# Altium project LGA Package.PrjPcb
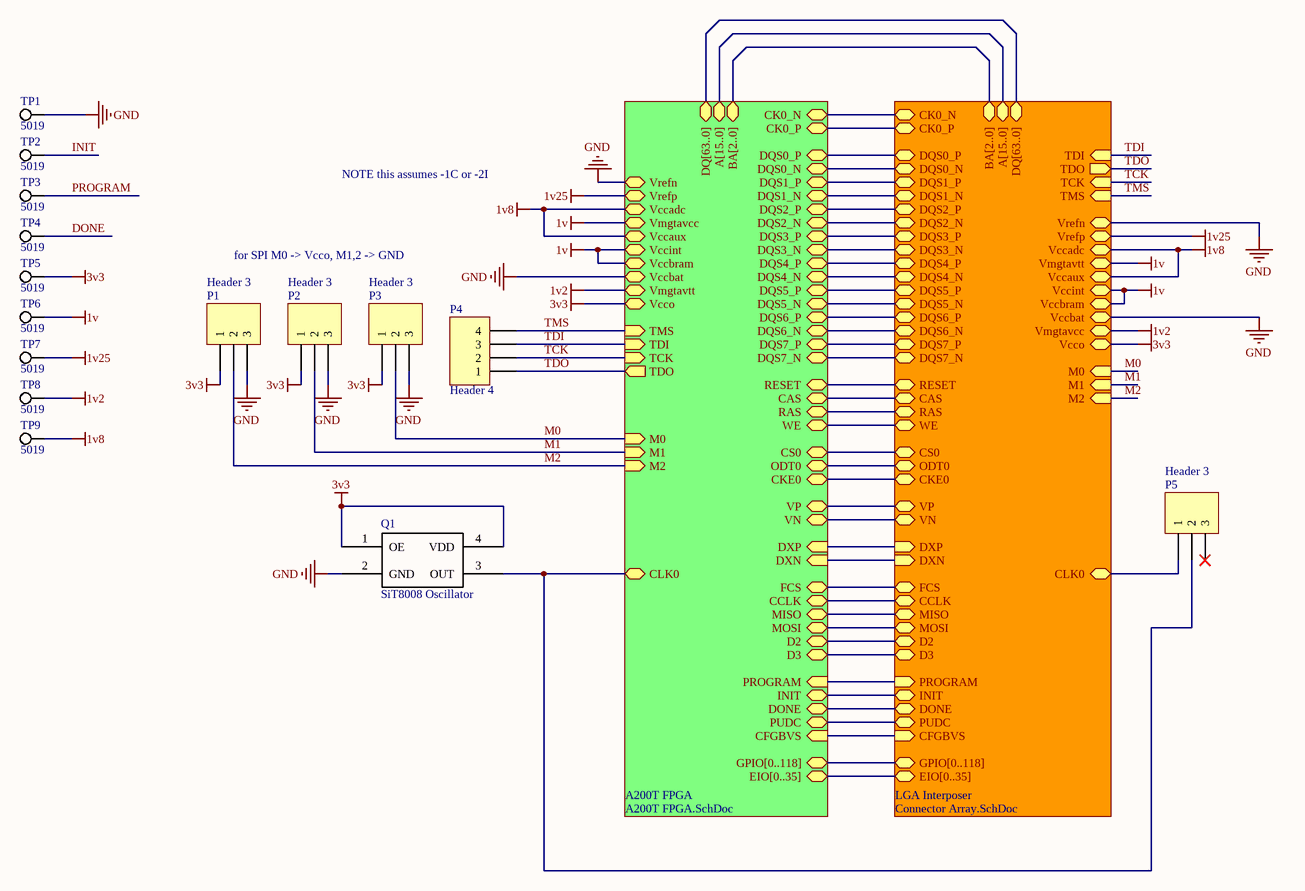
[diagram p0: Top.SchDoc]
3 sheets, 51 parts. Net scope: hierarchical (ports join the sheet entries above them; power ports are global).
Board file: LGA Interposer.PcbDoc
Sheets:
  Top.SchDoc
    A200T FPGA = A200T FPGA.SchDoc
    LGA Interposer = Connector Array.SchDoc

## Sheet Top.SchDoc
size A2; SheetNumber: 1; SheetTotal: 3

### Parts
P1  Header 3  [HDR1X3]
P2  Header 3  [HDR1X3]
P3  Header 3  [HDR1X3]
P4  Header 4  [HDR1X4]
P5  Header 3  [HDR1X3]
Q1  SiT8008 Oscillator  [SiT8008 2.5x2]
TP1  5019  [KSTN-5019_V]
TP2  5019  [KSTN-5019_V]
TP3  5019  [KSTN-5019_V]
TP4  5019  [KSTN-5019_V]
TP5  5019  [KSTN-5019_V]
TP6  5019  [KSTN-5019_V]
TP7  5019  [KSTN-5019_V]
TP8  5019  [KSTN-5019_V]
TP9  5019  [KSTN-5019_V]

### Sub-sheets
A200T FPGA = A200T FPGA.SchDoc: BA[2..0] (bidir), A[15..0] (bidir), DQS1_P (bidir), DQS2_N (bidir), DQS7_N (bidir), DQS0_P (bidir), DQS6_N (bidir), DQS6_P (bidir), DQS1_N (bidir), DQS7_P (bidir), DQS4_P (bidir), DQS5_N (bidir), DQS3_P (bidir), DQS0_N (bidir), DQS2_P (bidir), DQS3_N (bidir), DQS4_N (bidir), DQS5_P (bidir), RAS (bidir), RESET (bidir), WE (bidir), CAS (bidir), CK0_P (bidir), CK0_N (bidir), ODT0 (bidir), CS0 (bidir), CKE0 (bidir), Vrefp (bidir), Vccadc (bidir), Vmgtavcc (bidir), Vccaux (bidir), Vccint (bidir), Vccbram (bidir), Vccbat (bidir), Vmgtavtt (bidir), Vcco (bidir), DQ[63..0] (bidir), Vrefn (bidir), PUDC (bidir), FCS (bidir), CCLK (bidir), INIT (bidir), MISO (bidir), DONE (bidir), MOSI (bidir), D2 (bidir), D3 (bidir), CLK0 (bidir), VP (bidir), VN (bidir), EIO[0..35] (bidir), GPIO[0..118] (bidir), TDO (out), CFGBVS (in), TMS (in), TCK (in), PROGRAM (in), TDI (in), DXP (in), M2 (in), M0 (in), DXN (in), M1 (in)
LGA Interposer = Connector Array.SchDoc: DQS0_P (bidir), DQS0_N (bidir), DQS1_P (bidir), DQS1_N (bidir), DQS2_P (bidir), DQS2_N (bidir), DQS3_P (bidir), DQS3_N (bidir), DQS4_P (bidir), DQS4_N (bidir), DQS5_P (bidir), DQS5_N (bidir), DQS6_P (bidir), DQS6_N (bidir), DQS7_P (bidir), DQS7_N (bidir), DQ[63..0] (bidir), A[15..0] (bidir), BA[2..0] (bidir), CK0_N (bidir), CK0_P (bidir), RAS (bidir), CAS (bidir), WE (bidir), RESET (bidir), CKE0 (bidir), ODT0 (bidir), CS0 (bidir), TDI (in), TDO (out), TCK (in), TMS (in), DXP (in), DXN (in), CLK0 (bidir), M0 (in), CCLK (bidir), M1 (in), M2 (in), DONE (bidir), INIT (bidir), PROGRAM (in), CFGBVS (in), MOSI (bidir), MISO (bidir), PUDC (bidir), FCS (bidir), D2 (bidir), D3 (bidir), Vccint (bidir), Vccaux (bidir), Vccbram (bidir), Vcco (bidir), Vccbat (bidir), Vmgtavcc (bidir), Vmgtavtt (bidir), Vccadc (bidir), Vrefp (bidir), Vrefn (bidir), EIO[0..35] (bidir), GPIO[0..118] (bidir), VP (bidir), VN (bidir)

### Nets
1v: TP6.1 ; sheet A200T FPGA/Vmgtavcc, sheet A200T FPGA/Vccint, sheet A200T FPGA/Vccbram, sheet LGA Interposer/Vccint, sheet LGA Interposer/Vccbram, sheet LGA Interposer/Vmgtavtt  [project net Vccbram]
1v2: TP8.1 ; sheet A200T FPGA/Vmgtavtt, sheet LGA Interposer/Vmgtavcc  [project net Vmgtavcc]
1v8: TP9.1 ; sheet A200T FPGA/Vccadc, sheet A200T FPGA/Vccaux, sheet LGA Interposer/Vccaux, sheet LGA Interposer/Vccadc  [project net Vccadc]
1v25: TP7.1 ; sheet A200T FPGA/Vrefp, sheet LGA Interposer/Vrefp  [project net Vrefp]
3v3: P1.1 P2.1 P3.1 Q1.1(OE) Q1.4(VDD) TP5.1 ; sheet A200T FPGA/Vcco, sheet LGA Interposer/Vcco  [project net Vcco]
GND: P1.3 P2.3 P3.3 Q1.2(GND) TP1.1 ; sheet A200T FPGA/Vccbat, sheet A200T FPGA/Vrefn, sheet LGA Interposer/Vccbat, sheet LGA Interposer/Vrefn  [project net Vccbat]
CAS: sheet A200T FPGA/CAS, sheet LGA Interposer/CAS
CCLK: sheet A200T FPGA/CCLK, sheet LGA Interposer/CCLK
CFGBVS: sheet A200T FPGA/CFGBVS, sheet LGA Interposer/CFGBVS
CK0_N: sheet A200T FPGA/CK0_N, sheet LGA Interposer/CK0_N
CK0_P: sheet A200T FPGA/CK0_P, sheet LGA Interposer/CK0_P
CKE0: sheet A200T FPGA/CKE0, sheet LGA Interposer/CKE0
CLK0: P5.2 Q1.3(OUT) ; sheet A200T FPGA/CLK0
CLK0: P5.1 ; sheet LGA Interposer/CLK0  [a separate net that carries the same name]
CS0: sheet A200T FPGA/CS0, sheet LGA Interposer/CS0
D2: sheet A200T FPGA/D2, sheet LGA Interposer/D2
D3: sheet A200T FPGA/D3, sheet LGA Interposer/D3
DONE: TP4.1
DONE: sheet A200T FPGA/DONE, sheet LGA Interposer/DONE  [a separate net that carries the same name]
DQS0_N: sheet A200T FPGA/DQS0_N, sheet LGA Interposer/DQS0_N
DQS0_P: sheet A200T FPGA/DQS0_P, sheet LGA Interposer/DQS0_P
DQS1_N: sheet A200T FPGA/DQS1_N, sheet LGA Interposer/DQS1_N
DQS1_P: sheet A200T FPGA/DQS1_P, sheet LGA Interposer/DQS1_P
DQS2_N: sheet A200T FPGA/DQS2_N, sheet LGA Interposer/DQS2_N
DQS2_P: sheet A200T FPGA/DQS2_P, sheet LGA Interposer/DQS2_P
DQS3_N: sheet A200T FPGA/DQS3_N, sheet LGA Interposer/DQS3_N
DQS3_P: sheet A200T FPGA/DQS3_P, sheet LGA Interposer/DQS3_P
DQS4_N: sheet A200T FPGA/DQS4_N, sheet LGA Interposer/DQS4_N
DQS4_P: sheet A200T FPGA/DQS4_P, sheet LGA Interposer/DQS4_P
DQS5_N: sheet A200T FPGA/DQS5_N, sheet LGA Interposer/DQS5_N
DQS5_P: sheet A200T FPGA/DQS5_P, sheet LGA Interposer/DQS5_P
DQS6_N: sheet A200T FPGA/DQS6_N, sheet LGA Interposer/DQS6_N
DQS6_P: sheet A200T FPGA/DQS6_P, sheet LGA Interposer/DQS6_P
DQS7_N: sheet A200T FPGA/DQS7_N, sheet LGA Interposer/DQS7_N
DQS7_P: sheet A200T FPGA/DQS7_P, sheet LGA Interposer/DQS7_P
DXN: sheet A200T FPGA/DXN, sheet LGA Interposer/DXN
DXP: sheet A200T FPGA/DXP, sheet LGA Interposer/DXP
FCS: sheet A200T FPGA/FCS, sheet LGA Interposer/FCS
INIT: TP2.1
INIT: sheet A200T FPGA/INIT, sheet LGA Interposer/INIT  [a separate net that carries the same name]
M0: P3.2 ; sheet A200T FPGA/M0, sheet LGA Interposer/M0
M1: P2.2 ; sheet A200T FPGA/M1, sheet LGA Interposer/M1
M2: P1.2 ; sheet A200T FPGA/M2, sheet LGA Interposer/M2
MISO: sheet A200T FPGA/MISO, sheet LGA Interposer/MISO
MOSI: sheet A200T FPGA/MOSI, sheet LGA Interposer/MOSI
ODT0: sheet A200T FPGA/ODT0, sheet LGA Interposer/ODT0
PROGRAM: TP3.1
PROGRAM: sheet A200T FPGA/PROGRAM, sheet LGA Interposer/PROGRAM  [a separate net that carries the same name]
PUDC: sheet A200T FPGA/PUDC, sheet LGA Interposer/PUDC
RAS: sheet A200T FPGA/RAS, sheet LGA Interposer/RAS
RESET: sheet A200T FPGA/RESET, sheet LGA Interposer/RESET
TCK: P4.2 ; sheet A200T FPGA/TCK, sheet LGA Interposer/TCK
TDI: P4.3 ; sheet A200T FPGA/TDI, sheet LGA Interposer/TDI
TDO: P4.1 ; sheet A200T FPGA/TDO, sheet LGA Interposer/TDO
TMS: P4.4 ; sheet A200T FPGA/TMS, sheet LGA Interposer/TMS
VN: sheet A200T FPGA/VN, sheet LGA Interposer/VN
VP: sheet A200T FPGA/VP, sheet LGA Interposer/VP
WE: sheet A200T FPGA/WE, sheet LGA Interposer/WE

Not connected (* = marked no-connect by the designer): P5 3*

### Buses and harness runs
bus sheet A200T FPGA/A[15..0] = sheet LGA Interposer/A[15..0]
bus sheet A200T FPGA/BA[2..0] = sheet LGA Interposer/BA[2..0]
bus sheet A200T FPGA/DQ[63..0] = sheet LGA Interposer/DQ[63..0]
bus sheet A200T FPGA/EIO[0..35] = sheet LGA Interposer/EIO[0..35]
bus sheet A200T FPGA/GPIO[0..118] = sheet LGA Interposer/GPIO[0..118]

### Notes on the sheet
- NOTE this assumes -1C or -2I
- for SPI M0 -> Vcco, M1,2 -> GND

### Library data of the parts
P1-P3 P5 = Header 3: Header, 3-Pin; LatestRevisionDate: 17-Jul-2002; LatestRevisionNote: Re-released for DXP Platform.; Publisher: Altium Limited
P4 = Header 4: Header, 4-Pin; LatestRevisionDate: 17-Jul-2002; LatestRevisionNote: Re-released for DXP Platform.; Publisher: Altium Limited
TP1-TP9 = CMP-1672-00008-1: Test Point, 1 Position SMD, RoHS, Tape and Reel; ComponentLink1Description: Manufacturer URL; Package Quantity: 1000; DatasheetVersion: 03/2014; Packaging: Tape and Reel; ComponentLink2URL: http://www.keyelco.com/product-pdf.cfm?p=1357; ComponentLink1URL: http://www.keyelco.com/; Mount: Surface Mount; Contact Plating: Silver; PackageDescription: 1-Pin Surface Mount Device, Body 3.81 x 2.03 mm; Pins: 1; RoHSCompliant: True; Mounting Technology: Surface Mount; ComponentLink2Description: Datasheet; PackageReference: 5019

## Sheet A200T FPGA.SchDoc
size A1; SheetNumber: 3; SheetTotal: 3
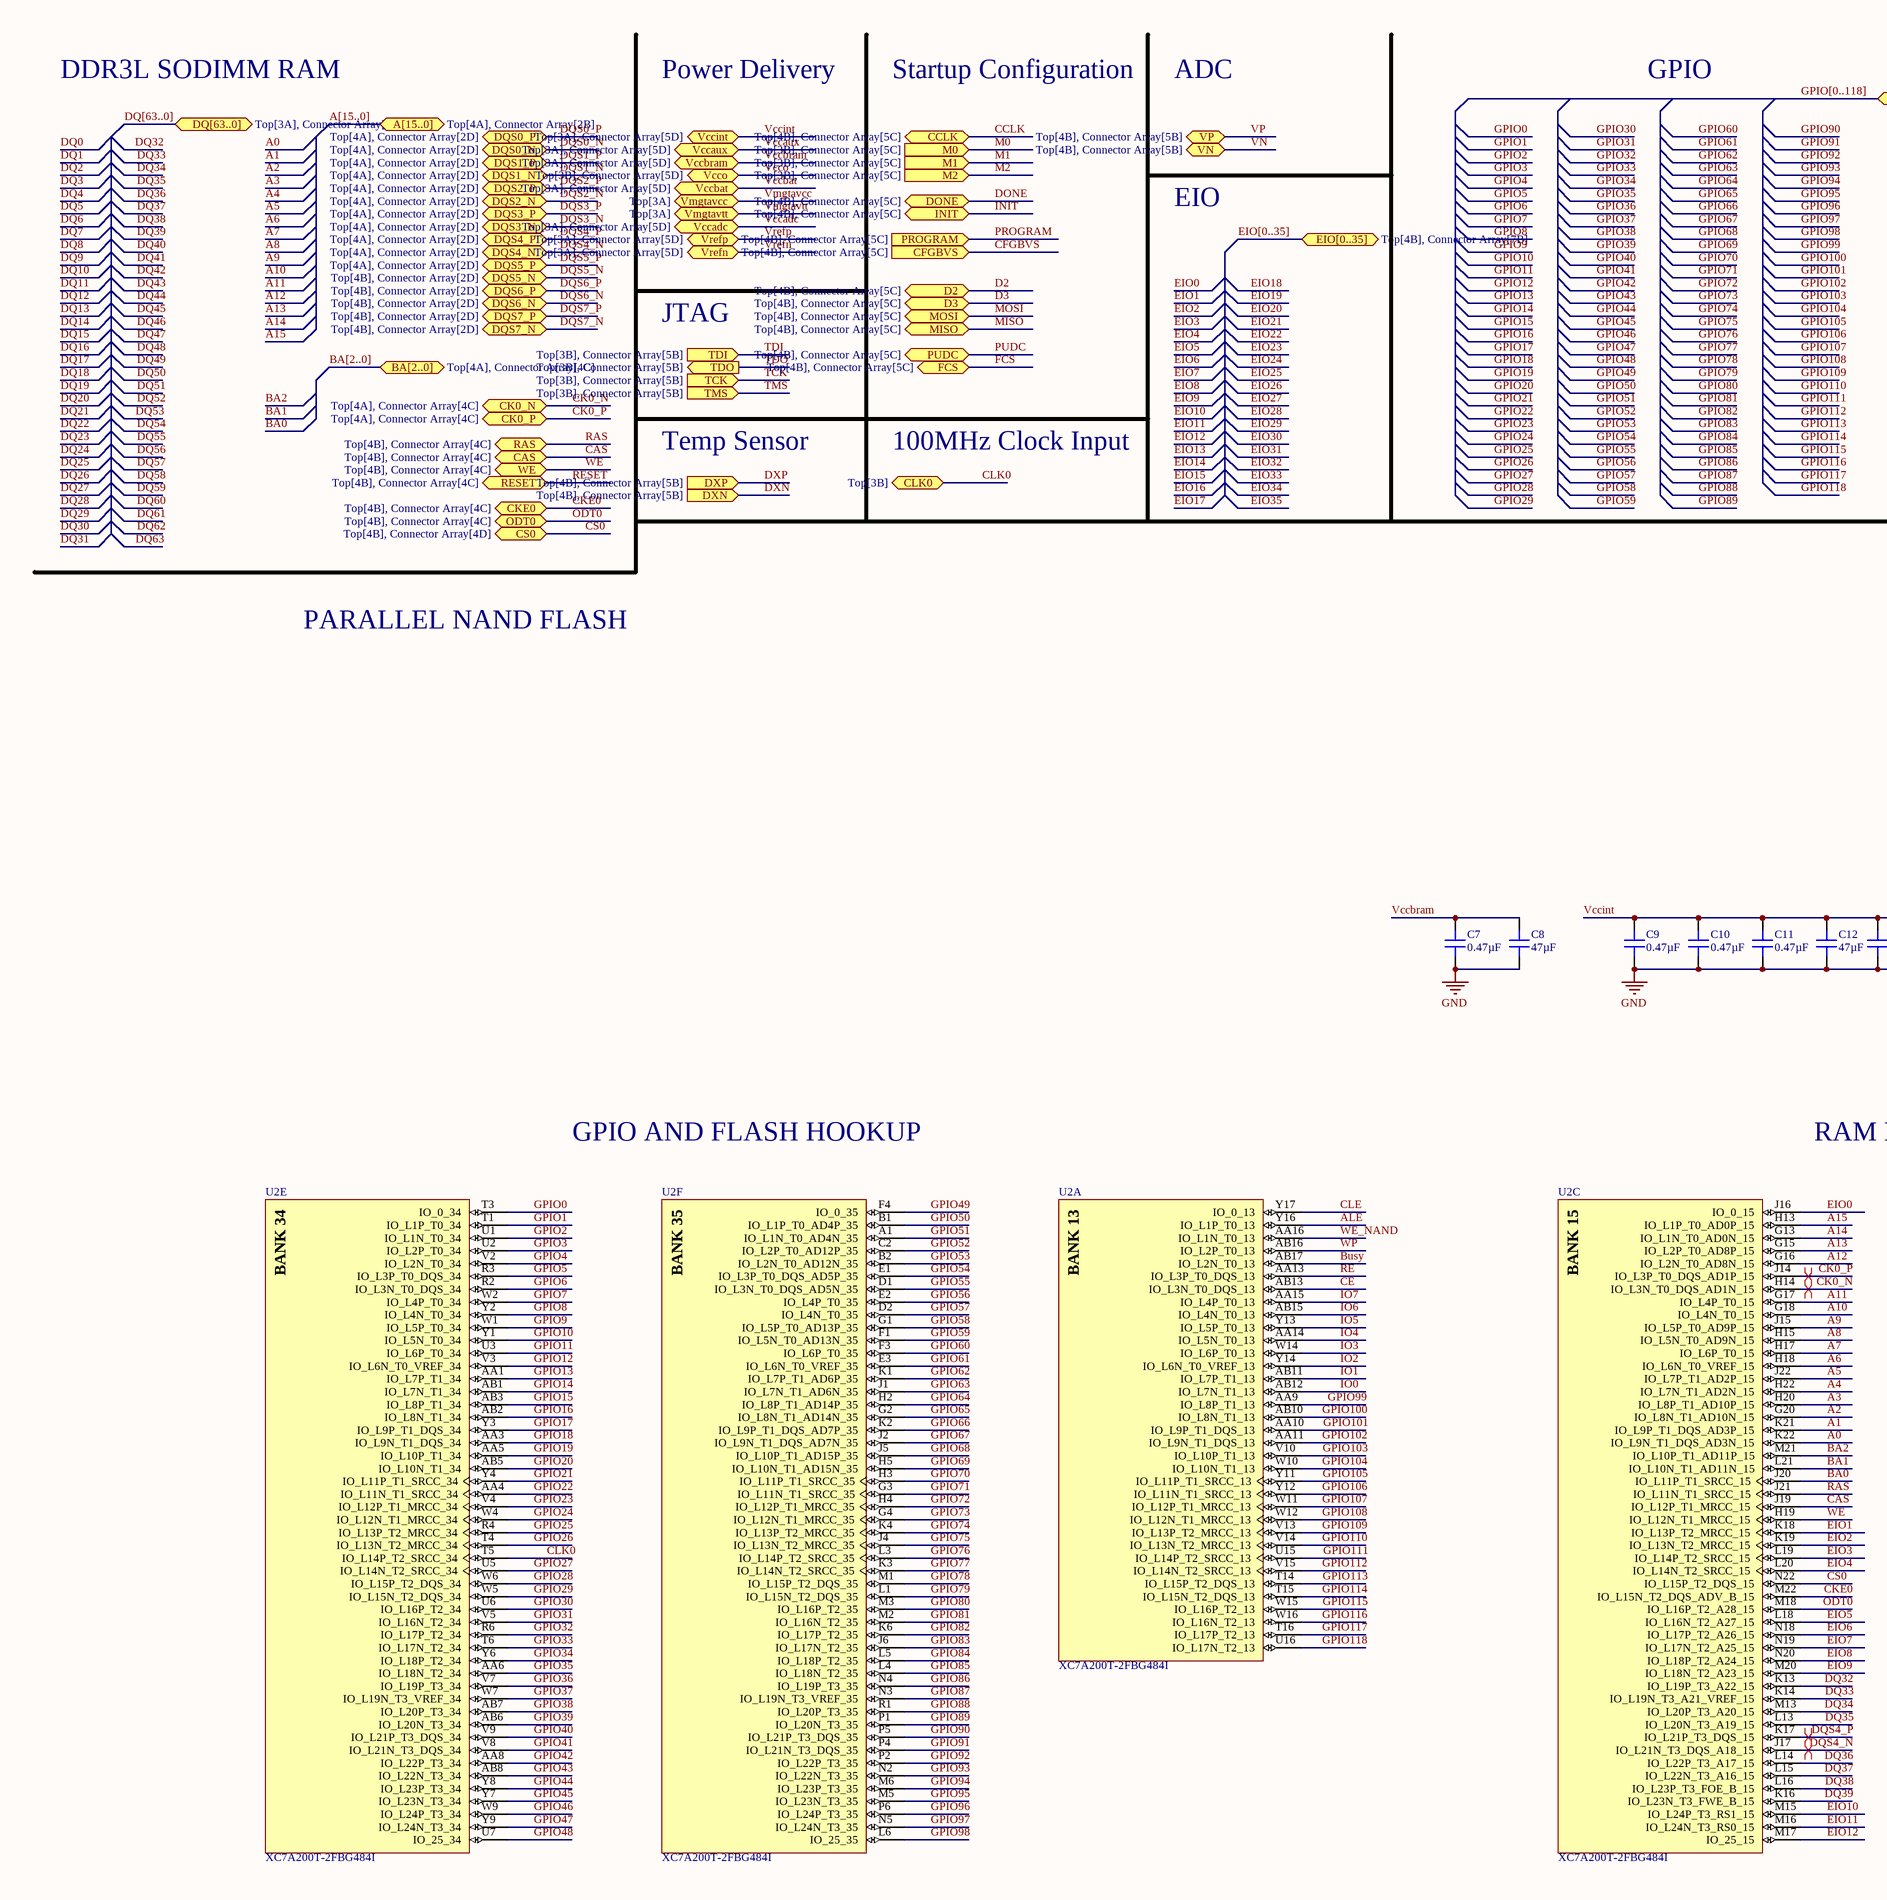
[diagram p1: A200T FPGA.SchDoc, left]
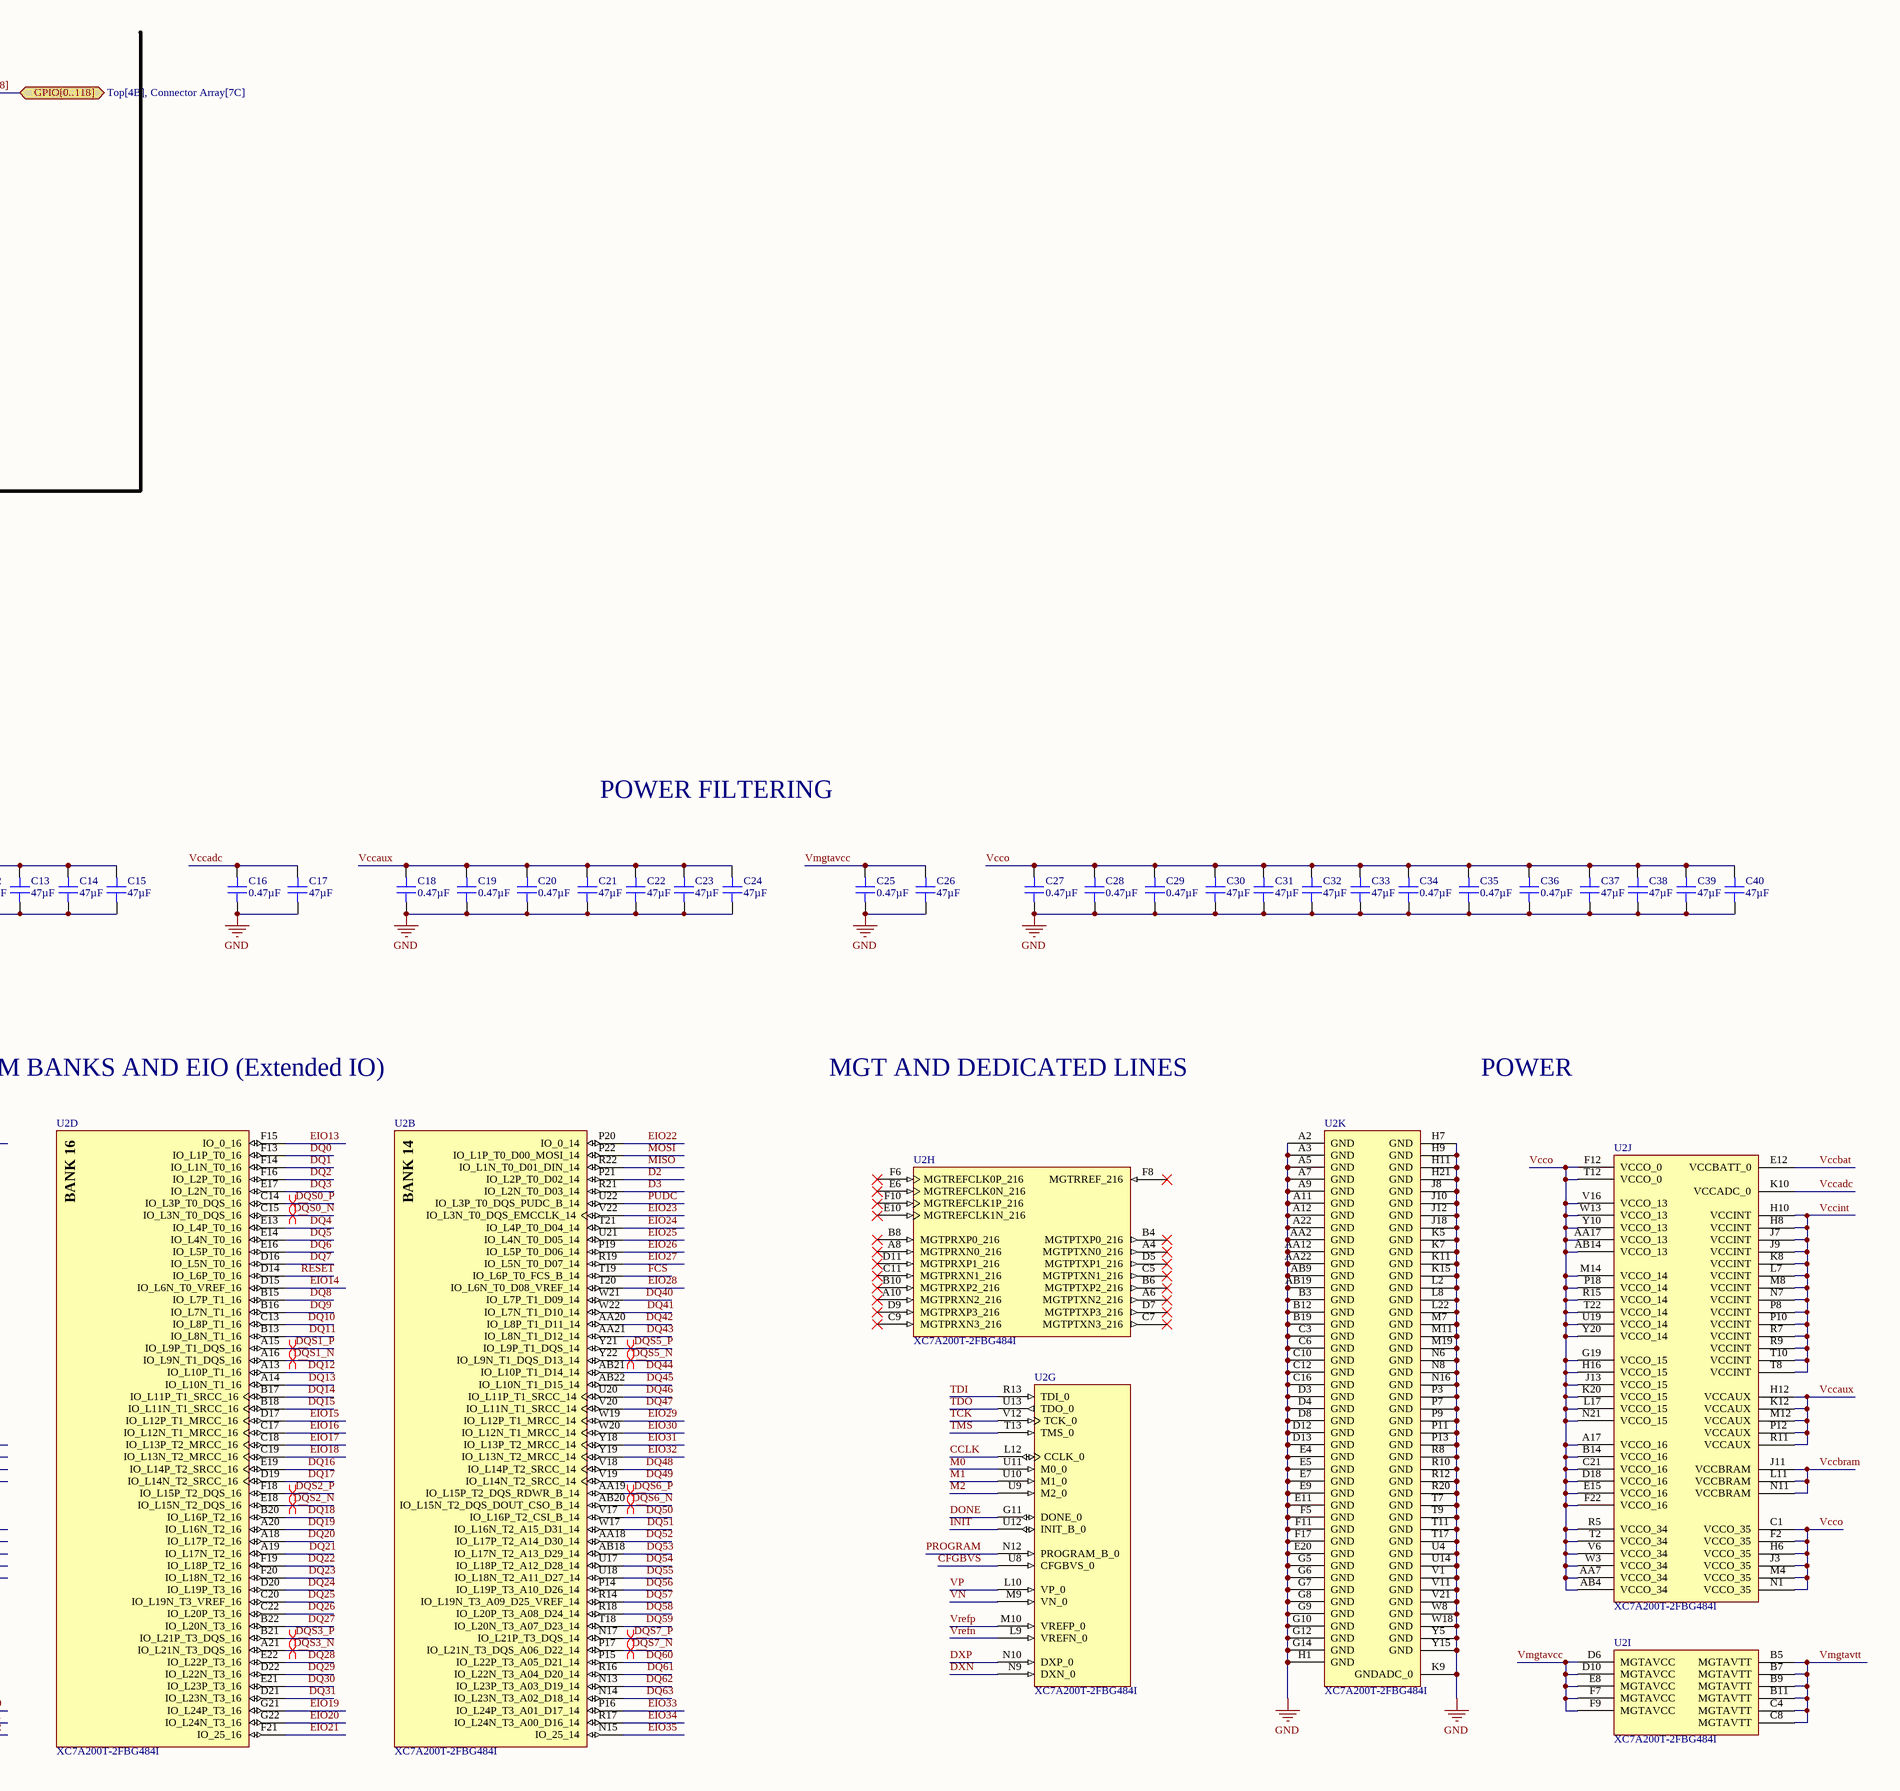
[diagram p2: A200T FPGA.SchDoc, right]

### Parts
C7  0.47µF  [CAP 0603_1608]
C8  47µF  [CAP 0805_2012]
C9  0.47µF  [CAP 0603_1608]
C10  0.47µF  [CAP 0603_1608]
C11  0.47µF  [CAP 0603_1608]
C12  47µF  [CAP 0805_2012]
C13  47µF  [CAP 0805_2012]
C14  47µF  [CAP 0805_2012]
C15  47µF  [CAP 0805_2012]
C16  0.47µF  [CAP 0603_1608]
C17  47µF  [CAP 0805_2012]
C18  0.47µF  [CAP 0603_1608]
C19  0.47µF  [CAP 0603_1608]
C20  0.47µF  [CAP 0603_1608]
C21  47µF  [CAP 0805_2012]
C22  47µF  [CAP 0805_2012]
C23  47µF  [CAP 0805_2012]
C24  47µF  [CAP 0805_2012]
C25  0.47µF  [CAP 0603_1608]
C26  47µF  [CAP 0805_2012]
C27  0.47µF  [CAP 0603_1608]
C28  0.47µF  [CAP 0603_1608]
C29  0.47µF  [CAP 0603_1608]
C30  47µF  [CAP 0805_2012]
C31  47µF  [CAP 0805_2012]
C32  47µF  [CAP 0805_2012]
C33  47µF  [CAP 0805_2012]
C34  0.47µF  [CAP 0603_1608]
C35  0.47µF  [CAP 0603_1608]
C36  0.47µF  [CAP 0603_1608]
C37  47µF  [CAP 0805_2012]
C38  47µF  [CAP 0805_2012]
C39  47µF  [CAP 0805_2012]
C40  47µF  [CAP 0805_2012]
U2  XC7A200T-2FBG484I  [FBG484]  (parts A,B,C,D,E,F,G,H,I,J,K of 11)

### Ports
A[15..0] (bidir, see Top[4A], Connector Array[2B]), BA[2..0] (bidir, see Top[4A], Connector Array[4C]), CAS (bidir, see Top[4B], Connector Array[4C]), CCLK (bidir, see Top[4B], Connector Array[5C]), CFGBVS (in, see Top[4B], Connector Array[5C]), CK0_N (bidir, see Top[4A], Connector Array[4C]), CK0_P (bidir, see Top[4A], Connector Array[4C]), CKE0 (bidir, see Top[4B], Connector Array[4C]), CLK0 (bidir, see Top[3B]), CS0 (bidir, see Top[4B], Connector Array[4D]), D2 (bidir, see Top[4B], Connector Array[5C]), D3 (bidir, see Top[4B], Connector Array[5C]), DONE (bidir, see Top[4B], Connector Array[5C]), DQ[63..0] (bidir, see Top[3A], Connector Array[2C]), DQS0_N (bidir, see Top[4A], Connector Array[2D]), DQS0_P (bidir, see Top[4A], Connector Array[2D]), DQS1_N (bidir, see Top[4A], Connector Array[2D]), DQS1_P (bidir, see Top[4A], Connector Array[2D]), DQS2_N (bidir, see Top[4A], Connector Array[2D]), DQS2_P (bidir, see Top[4A], Connector Array[2D]), DQS3_N (bidir, see Top[4A], Connector Array[2D]), DQS3_P (bidir, see Top[4A], Connector Array[2D]), DQS4_N (bidir, see Top[4A], Connector Array[2D]), DQS4_P (bidir, see Top[4A], Connector Array[2D]), DQS5_N (bidir, see Top[4B], Connector Array[2D]), DQS5_P (bidir, see Top[4A], Connector Array[2D]), DQS6_N (bidir, see Top[4B], Connector Array[2D]), DQS6_P (bidir, see Top[4B], Connector Array[2D]), DQS7_N (bidir, see Top[4B], Connector Array[2D]), DQS7_P (bidir, see Top[4B], Connector Array[2D]), DXN (in, see Top[4B], Connector Array[5B]), DXP (in, see Top[4B], Connector Array[5B]), EIO[0..35] (bidir, see Top[4B], Connector Array[7B]), FCS (bidir, see Top[4B], Connector Array[5C]), GPIO[0..118] (bidir, see Top[4B], Connector Array[7C]), INIT (bidir, see Top[4B], Connector Array[5C]), M0 (in, see Top[3B], Connector Array[5C]), M1 (in, see Top[3B], Connector Array[5C]), M2 (in, see Top[3B], Connector Array[5C]), MISO (bidir, see Top[4B], Connector Array[5C]), MOSI (bidir, see Top[4B], Connector Array[5C]), ODT0 (bidir, see Top[4B], Connector Array[4C]), PROGRAM (in, see Top[4B], Connector Array[5C]), PUDC (bidir, see Top[4B], Connector Array[5C]), RAS (bidir, see Top[4B], Connector Array[4C]), RESET (bidir, see Top[4B], Connector Array[4C]), TCK (in, see Top[3B], Connector Array[5B]), TDI (in, see Top[3B], Connector Array[5B]), TDO (out, see Top[3B], Connector Array[5B]), TMS (in, see Top[3B], Connector Array[5B]), Vccadc (bidir, see Top[3A], Connector Array[5D]), Vccaux (bidir, see Top[3A], Connector Array[5D]), Vccbat (bidir, see Top[3A], Connector Array[5D]), Vccbram (bidir, see Top[3A], Connector Array[5D]), Vccint (bidir, see Top[3A], Connector Array[5D]), Vcco (bidir, see Top[3B], Connector Array[5D]), Vmgtavcc (bidir, see Top[3A]), Vmgtavtt (bidir, see Top[3A]), VN (bidir, see Top[4B], Connector Array[5B]), VP (bidir, see Top[4B], Connector Array[5B]), Vrefn (bidir, see Top[3A], Connector Array[5D]), Vrefp (bidir, see Top[3A], Connector Array[5D]), WE (bidir, see Top[4B], Connector Array[4C])

### Nets
Vccadc: C16.2 C17.2 C18.2 C19.2 C20.2 C21.2 C22.2 C23.2 C24.2 U2.H12(VCCAUX) U2.K10(VCCADC_0) U2.K12(VCCAUX) U2.M12(VCCAUX) U2.P12(VCCAUX) U2.R11(VCCAUX) ; port Vccaux, port Vccadc  [also labelled Vccaux]
Vccbat: C7.1 C8.1 C9.1 C10.1 C11.1 C12.1 C13.1 C14.1 C15.1 C16.1 C17.1 C18.1 C19.1 C20.1 C21.1 C22.1 C23.1 C24.1 C25.1 C26.1 C27.1 C28.1 C29.1 C30.1 C31.1 C32.1 C33.1 C34.1 C35.1 C36.1 C37.1 C38.1 C39.1 C40.1 U2.A2(GND) U2.A3(GND) U2.A5(GND) U2.A7(GND) U2.A9(GND) U2.A11(GND) U2.A12(GND) U2.A22(GND) U2.AA2(GND) U2.AA12(GND) U2.AA22(GND) U2.AB9(GND) U2.AB19(GND) U2.B3(GND) U2.B12(GND) U2.B19(GND) U2.C3(GND) U2.C6(GND) U2.C10(GND) U2.C12(GND) U2.C16(GND) U2.D3(GND) U2.D4(GND) U2.D8(GND) U2.D12(GND) U2.D13(GND) U2.E4(GND) U2.E5(GND) U2.E7(GND) U2.E9(GND) U2.E11(GND) U2.E12(VCCBATT_0) U2.E20(GND) U2.F5(GND) U2.F11(GND) U2.F17(GND) U2.G5(GND) U2.G6(GND) U2.G7(GND) U2.G8(GND) U2.G9(GND) U2.G10(GND) U2.G12(GND) U2.G14(GND) U2.H1(GND) U2.H7(GND) U2.H9(GND) U2.H11(GND) U2.H21(GND) U2.J8(GND) U2.J10(GND) U2.J12(GND) U2.J18(GND) U2.K5(GND) U2.K7(GND) U2.K9(GNDADC_0) U2.K11(GND) U2.K15(GND) U2.L2(GND) U2.L8(GND) U2.L9(VREFN_0) U2.L22(GND) U2.M7(GND) U2.M11(GND) U2.M19(GND) U2.N6(GND) U2.N8(GND) U2.N16(GND) U2.P3(GND) U2.P7(GND) U2.P9(GND) U2.P11(GND) U2.P13(GND) U2.R8(GND) U2.R10(GND) U2.R12(GND) U2.R20(GND) U2.T7(GND) U2.T9(GND) U2.T11(GND) U2.T17(GND) U2.U4(GND) U2.U14(GND) U2.V1(GND) U2.V11(GND) U2.V21(GND) U2.W8(GND) U2.W18(GND) U2.Y5(GND) U2.Y15(GND) ; port Vccbat, port Vrefn  [also labelled GND, Vrefn]
Vccbram: C7.2 C8.2 C9.2 C10.2 C11.2 C12.2 C13.2 C14.2 C15.2 C25.2 C26.2 U2.D6(MGTAVCC) U2.D10(MGTAVCC) U2.E8(MGTAVCC) U2.F7(MGTAVCC) U2.F9(MGTAVCC) U2.H8(VCCINT) U2.H10(VCCINT) U2.J7(VCCINT) U2.J9(VCCINT) U2.J11(VCCBRAM) U2.K8(VCCINT) U2.L7(VCCINT) U2.L11(VCCBRAM) U2.M8(VCCINT) U2.N7(VCCINT) U2.N11(VCCBRAM) U2.P8(VCCINT) U2.P10(VCCINT) U2.R7(VCCINT) U2.R9(VCCINT) U2.T8(VCCINT) U2.T10(VCCINT) ; port Vccint, port Vccbram, port Vmgtavcc  [also labelled Vccint, Vmgtavcc]
Vcco: C27.2 C28.2 C29.2 C30.2 C31.2 C32.2 C33.2 C34.2 C35.2 C36.2 C37.2 C38.2 C39.2 C40.2 U2.A17(VCCO_16) U2.AA7(VCCO_34) U2.AA17(VCCO_13) U2.AB4(VCCO_34) U2.AB14(VCCO_13) U2.B14(VCCO_16) U2.C1(VCCO_35) U2.C21(VCCO_16) U2.D18(VCCO_16) U2.E15(VCCO_16) U2.F2(VCCO_35) U2.F12(VCCO_0) U2.F22(VCCO_16) U2.G19(VCCO_15) U2.H6(VCCO_35) U2.H16(VCCO_15) U2.J3(VCCO_35) U2.J13(VCCO_15) U2.K20(VCCO_15) U2.L17(VCCO_15) U2.M4(VCCO_35) U2.M14(VCCO_14) U2.N1(VCCO_35) U2.N21(VCCO_15) U2.P18(VCCO_14) U2.R5(VCCO_34) U2.R15(VCCO_14) U2.T2(VCCO_34) U2.T12(VCCO_0) U2.T22(VCCO_14) U2.U19(VCCO_14) U2.V6(VCCO_34) U2.V16(VCCO_13) U2.W3(VCCO_34) U2.W13(VCCO_13) U2.Y10(VCCO_13) U2.Y20(VCCO_14) ; port Vcco
Vmgtavtt: U2.B5(MGTAVTT) U2.B7(MGTAVTT) U2.B9(MGTAVTT) U2.B11(MGTAVTT) U2.C4(MGTAVTT) U2.C8(MGTAVTT) ; port Vmgtavtt  [project net Vmgtavcc]
Vrefp: U2.M10(VREFP_0) ; port Vrefp
A0: U2.K22(IO_L9N_T1_DQS_AD3N_15)
A1: U2.K21(IO_L9P_T1_DQS_AD3P_15)
A2: U2.G20(IO_L8N_T1_AD10N_15)
A3: U2.H20(IO_L8P_T1_AD10P_15)
A4: U2.H22(IO_L7N_T1_AD2N_15)
A5: U2.J22(IO_L7P_T1_AD2P_15)
A6: U2.H18(IO_L6N_T0_VREF_15)
A7: U2.H17(IO_L6P_T0_15)
A8: U2.H15(IO_L5N_T0_AD9N_15)
A9: U2.J15(IO_L5P_T0_AD9P_15)
A10: U2.G18(IO_L4N_T0_15)
A11: U2.G17(IO_L4P_T0_15)
A12: U2.G16(IO_L2N_T0_AD8N_15)
A13: U2.G15(IO_L2P_T0_AD8P_15)
A14: U2.G13(IO_L1N_T0_AD0N_15)
A15: U2.H13(IO_L1P_T0_AD0P_15)
ALE: U2.Y16(IO_L1P_T0_13)
BA0: U2.J20(IO_L11P_T1_SRCC_15)
BA1: U2.L21(IO_L10N_T1_AD11N_15)
BA2: U2.M21(IO_L10P_T1_AD11P_15)
Busy: U2.AB17(IO_L2N_T0_13)
CAS: U2.J19(IO_L12P_T1_MRCC_15) ; port CAS
CCLK: U2.L12(CCLK_0) ; port CCLK
CE: U2.AB13(IO_L3N_T0_DQS_13)
CFGBVS: U2.U8(CFGBVS_0) ; port CFGBVS
CK0_N: U2.H14(IO_L3N_T0_DQS_AD1N_15) ; port CK0_N
CK0_P: U2.J14(IO_L3P_T0_DQS_AD1P_15) ; port CK0_P
CKE0: U2.M22(IO_L15N_T2_DQS_ADV_B_15) ; port CKE0
CLE: U2.Y17(IO_0_13)
CLK0: U2.T5(IO_L14P_T2_SRCC_34) ; port CLK0
CS0: U2.N22(IO_L15P_T2_DQS_15) ; port CS0
D2: U2.P21(IO_L2P_T0_D02_14) ; port D2
D3: U2.R21(IO_L2N_T0_D03_14) ; port D3
DONE: U2.G11(DONE_0) ; port DONE
DQ0: U2.F13(IO_L1P_T0_16)
DQ1: U2.F14(IO_L1N_T0_16)
DQ2: U2.F16(IO_L2P_T0_16)
DQ3: U2.E17(IO_L2N_T0_16)
DQ4: U2.E13(IO_L4P_T0_16)
DQ5: U2.E14(IO_L4N_T0_16)
DQ6: U2.E16(IO_L5P_T0_16)
DQ7: U2.D16(IO_L5N_T0_16)
DQ8: U2.B15(IO_L7P_T1_16)
DQ9: U2.B16(IO_L7N_T1_16)
DQ10: U2.C13(IO_L8P_T1_16)
DQ11: U2.B13(IO_L8N_T1_16)
DQ12: U2.A13(IO_L10P_T1_16)
DQ13: U2.A14(IO_L10N_T1_16)
DQ14: U2.B17(IO_L11P_T1_SRCC_16)
DQ15: U2.B18(IO_L11N_T1_SRCC_16)
DQ16: U2.E19(IO_L14P_T2_SRCC_16)
DQ17: U2.D19(IO_L14N_T2_SRCC_16)
DQ18: U2.B20(IO_L16P_T2_16)
DQ19: U2.A20(IO_L16N_T2_16)
DQ20: U2.A18(IO_L17P_T2_16)
DQ21: U2.A19(IO_L17N_T2_16)
DQ22: U2.F19(IO_L18P_T2_16)
DQ23: U2.F20(IO_L18N_T2_16)
DQ24: U2.D20(IO_L19P_T3_16)
DQ25: U2.C20(IO_L19N_T3_VREF_16)
DQ26: U2.C22(IO_L20P_T3_16)
DQ27: U2.B22(IO_L20N_T3_16)
DQ28: U2.E22(IO_L22P_T3_16)
DQ29: U2.D22(IO_L22N_T3_16)
DQ30: U2.E21(IO_L23P_T3_16)
DQ31: U2.D21(IO_L23N_T3_16)
DQ32: U2.K13(IO_L19P_T3_A22_15)
DQ33: U2.K14(IO_L19N_T3_A21_VREF_15)
DQ34: U2.M13(IO_L20P_T3_A20_15)
DQ35: U2.L13(IO_L20N_T3_A19_15)
DQ36: U2.L14(IO_L22P_T3_A17_15)
DQ37: U2.L15(IO_L22N_T3_A16_15)
DQ38: U2.L16(IO_L23P_T3_FOE_B_15)
DQ39: U2.K16(IO_L23N_T3_FWE_B_15)
DQ40: U2.W21(IO_L7P_T1_D09_14)
DQ41: U2.W22(IO_L7N_T1_D10_14)
DQ42: U2.AA20(IO_L8P_T1_D11_14)
DQ43: U2.AA21(IO_L8N_T1_D12_14)
DQ44: U2.AB21(IO_L10P_T1_D14_14)
DQ45: U2.AB22(IO_L10N_T1_D15_14)
DQ46: U2.U20(IO_L11P_T1_SRCC_14)
DQ47: U2.V20(IO_L11N_T1_SRCC_14)
DQ48: U2.V18(IO_L14P_T2_SRCC_14)
DQ49: U2.V19(IO_L14N_T2_SRCC_14)
DQ50: U2.V17(IO_L16P_T2_CSI_B_14)
DQ51: U2.W17(IO_L16N_T2_A15_D31_14)
DQ52: U2.AA18(IO_L17P_T2_A14_D30_14)
DQ53: U2.AB18(IO_L17N_T2_A13_D29_14)
DQ54: U2.U17(IO_L18P_T2_A12_D28_14)
DQ55: U2.U18(IO_L18N_T2_A11_D27_14)
DQ56: U2.P14(IO_L19P_T3_A10_D26_14)
DQ57: U2.R14(IO_L19N_T3_A09_D25_VREF_14)
DQ58: U2.R18(IO_L20P_T3_A08_D24_14)
DQ59: U2.T18(IO_L20N_T3_A07_D23_14)
DQ60: U2.P15(IO_L22P_T3_A05_D21_14)
DQ61: U2.R16(IO_L22N_T3_A04_D20_14)
DQ62: U2.N13(IO_L23P_T3_A03_D19_14)
DQ63: U2.N14(IO_L23N_T3_A02_D18_14)
DQS0_N: U2.C15(IO_L3N_T0_DQS_16) ; port DQS0_N
DQS0_P: U2.C14(IO_L3P_T0_DQS_16) ; port DQS0_P
DQS1_N: U2.A16(IO_L9N_T1_DQS_16) ; port DQS1_N
DQS1_P: U2.A15(IO_L9P_T1_DQS_16) ; port DQS1_P
DQS2_N: U2.E18(IO_L15N_T2_DQS_16) ; port DQS2_N
DQS2_P: U2.F18(IO_L15P_T2_DQS_16) ; port DQS2_P
DQS3_N: U2.A21(IO_L21N_T3_DQS_16) ; port DQS3_N
DQS3_P: U2.B21(IO_L21P_T3_DQS_16) ; port DQS3_P
DQS4_N: U2.J17(IO_L21N_T3_DQS_A18_15) ; port DQS4_N
DQS4_P: U2.K17(IO_L21P_T3_DQS_15) ; port DQS4_P
DQS5_N: U2.Y22(IO_L9N_T1_DQS_D13_14) ; port DQS5_N
DQS5_P: U2.Y21(IO_L9P_T1_DQS_14) ; port DQS5_P
DQS6_N: U2.AB20(IO_L15N_T2_DQS_DOUT_CSO_B_14) ; port DQS6_N
DQS6_P: U2.AA19(IO_L15P_T2_DQS_RDWR_B_14) ; port DQS6_P
DQS7_N: U2.P17(IO_L21N_T3_DQS_A06_D22_14) ; port DQS7_N
DQS7_P: U2.N17(IO_L21P_T3_DQS_14) ; port DQS7_P
DXN: U2.N9(DXN_0) ; port DXN
DXP: U2.N10(DXP_0) ; port DXP
EIO0: U2.J16(IO_0_15)
EIO1: U2.K18(IO_L13P_T2_MRCC_15)
EIO2: U2.K19(IO_L13N_T2_MRCC_15)
EIO3: U2.L19(IO_L14P_T2_SRCC_15)
EIO4: U2.L20(IO_L14N_T2_SRCC_15)
EIO5: U2.L18(IO_L16N_T2_A27_15)
EIO6: U2.N18(IO_L17P_T2_A26_15)
EIO7: U2.N19(IO_L17N_T2_A25_15)
EIO8: U2.N20(IO_L18P_T2_A24_15)
EIO9: U2.M20(IO_L18N_T2_A23_15)
EIO10: U2.M15(IO_L24P_T3_RS1_15)
EIO11: U2.M16(IO_L24N_T3_RS0_15)
EIO12: U2.M17(IO_25_15)
EIO13: U2.F15(IO_0_16)
EIO14: U2.D15(IO_L6N_T0_VREF_16)
EIO15: U2.D17(IO_L12P_T1_MRCC_16)
EIO16: U2.C17(IO_L12N_T1_MRCC_16)
EIO17: U2.C18(IO_L13P_T2_MRCC_16)
EIO18: U2.C19(IO_L13N_T2_MRCC_16)
EIO19: U2.G21(IO_L24P_T3_16)
EIO20: U2.G22(IO_L24N_T3_16)
EIO21: U2.F21(IO_25_16)
EIO22: U2.P20(IO_0_14)
EIO23: U2.V22(IO_L3N_T0_DQS_EMCCLK_14)
EIO24: U2.T21(IO_L4P_T0_D04_14)
EIO25: U2.U21(IO_L4N_T0_D05_14)
EIO26: U2.P19(IO_L5P_T0_D06_14)
EIO27: U2.R19(IO_L5N_T0_D07_14)
EIO28: U2.T20(IO_L6N_T0_D08_VREF_14)
EIO29: U2.W19(IO_L12P_T1_MRCC_14)
EIO30: U2.W20(IO_L12N_T1_MRCC_14)
EIO31: U2.Y18(IO_L13P_T2_MRCC_14)
EIO32: U2.Y19(IO_L13N_T2_MRCC_14)
EIO33: U2.P16(IO_L24P_T3_A01_D17_14)
EIO34: U2.R17(IO_L24N_T3_A00_D16_14)
EIO35: U2.N15(IO_25_14)
FCS: U2.T19(IO_L6P_T0_FCS_B_14) ; port FCS
GPIO0: U2.T3(IO_0_34)
GPIO1: U2.T1(IO_L1P_T0_34)
GPIO2: U2.U1(IO_L1N_T0_34)
GPIO3: U2.U2(IO_L2P_T0_34)
GPIO4: U2.V2(IO_L2N_T0_34)
GPIO5: U2.R3(IO_L3P_T0_DQS_34)
GPIO6: U2.R2(IO_L3N_T0_DQS_34)
GPIO7: U2.W2(IO_L4P_T0_34)
GPIO8: U2.Y2(IO_L4N_T0_34)
GPIO9: U2.W1(IO_L5P_T0_34)
GPIO10: U2.Y1(IO_L5N_T0_34)
GPIO11: U2.U3(IO_L6P_T0_34)
GPIO12: U2.V3(IO_L6N_T0_VREF_34)
GPIO13: U2.AA1(IO_L7P_T1_34)
GPIO14: U2.AB1(IO_L7N_T1_34)
GPIO15: U2.AB3(IO_L8P_T1_34)
GPIO16: U2.AB2(IO_L8N_T1_34)
GPIO17: U2.Y3(IO_L9P_T1_DQS_34)
GPIO18: U2.AA3(IO_L9N_T1_DQS_34)
GPIO19: U2.AA5(IO_L10P_T1_34)
GPIO20: U2.AB5(IO_L10N_T1_34)
GPIO21: U2.Y4(IO_L11P_T1_SRCC_34)
GPIO22: U2.AA4(IO_L11N_T1_SRCC_34)
GPIO23: U2.V4(IO_L12P_T1_MRCC_34)
GPIO24: U2.W4(IO_L12N_T1_MRCC_34)
GPIO25: U2.R4(IO_L13P_T2_MRCC_34)
GPIO26: U2.T4(IO_L13N_T2_MRCC_34)
GPIO27: U2.U5(IO_L14N_T2_SRCC_34)
GPIO28: U2.W6(IO_L15P_T2_DQS_34)
GPIO29: U2.W5(IO_L15N_T2_DQS_34)
GPIO30: U2.U6(IO_L16P_T2_34)
GPIO31: U2.V5(IO_L16N_T2_34)
GPIO32: U2.R6(IO_L17P_T2_34)
GPIO33: U2.T6(IO_L17N_T2_34)
GPIO34: U2.Y6(IO_L18P_T2_34)
GPIO35: U2.AA6(IO_L18N_T2_34)
GPIO36: U2.V7(IO_L19P_T3_34)
GPIO37: U2.W7(IO_L19N_T3_VREF_34)
GPIO38: U2.AB7(IO_L20P_T3_34)
GPIO39: U2.AB6(IO_L20N_T3_34)
GPIO40: U2.V9(IO_L21P_T3_DQS_34)
GPIO41: U2.V8(IO_L21N_T3_DQS_34)
GPIO42: U2.AA8(IO_L22P_T3_34)
GPIO43: U2.AB8(IO_L22N_T3_34)
GPIO44: U2.Y8(IO_L23P_T3_34)
GPIO45: U2.Y7(IO_L23N_T3_34)
GPIO46: U2.W9(IO_L24P_T3_34)
GPIO47: U2.Y9(IO_L24N_T3_34)
GPIO48: U2.U7(IO_25_34)
GPIO49: U2.F4(IO_0_35)
GPIO50: U2.B1(IO_L1P_T0_AD4P_35)
GPIO51: U2.A1(IO_L1N_T0_AD4N_35)
GPIO52: U2.C2(IO_L2P_T0_AD12P_35)
GPIO53: U2.B2(IO_L2N_T0_AD12N_35)
GPIO54: U2.E1(IO_L3P_T0_DQS_AD5P_35)
GPIO55: U2.D1(IO_L3N_T0_DQS_AD5N_35)
GPIO56: U2.E2(IO_L4P_T0_35)
GPIO57: U2.D2(IO_L4N_T0_35)
GPIO58: U2.G1(IO_L5P_T0_AD13P_35)
GPIO59: U2.F1(IO_L5N_T0_AD13N_35)
GPIO60: U2.F3(IO_L6P_T0_35)
GPIO61: U2.E3(IO_L6N_T0_VREF_35)
GPIO62: U2.K1(IO_L7P_T1_AD6P_35)
GPIO63: U2.J1(IO_L7N_T1_AD6N_35)
GPIO64: U2.H2(IO_L8P_T1_AD14P_35)
GPIO65: U2.G2(IO_L8N_T1_AD14N_35)
GPIO66: U2.K2(IO_L9P_T1_DQS_AD7P_35)
GPIO67: U2.J2(IO_L9N_T1_DQS_AD7N_35)
GPIO68: U2.J5(IO_L10P_T1_AD15P_35)
GPIO69: U2.H5(IO_L10N_T1_AD15N_35)
GPIO70: U2.H3(IO_L11P_T1_SRCC_35)
GPIO71: U2.G3(IO_L11N_T1_SRCC_35)
GPIO72: U2.H4(IO_L12P_T1_MRCC_35)
GPIO73: U2.G4(IO_L12N_T1_MRCC_35)
GPIO74: U2.K4(IO_L13P_T2_MRCC_35)
GPIO75: U2.J4(IO_L13N_T2_MRCC_35)
GPIO76: U2.L3(IO_L14P_T2_SRCC_35)
GPIO77: U2.K3(IO_L14N_T2_SRCC_35)
GPIO78: U2.M1(IO_L15P_T2_DQS_35)
GPIO79: U2.L1(IO_L15N_T2_DQS_35)
GPIO80: U2.M3(IO_L16P_T2_35)
GPIO81: U2.M2(IO_L16N_T2_35)
GPIO82: U2.K6(IO_L17P_T2_35)
GPIO83: U2.J6(IO_L17N_T2_35)
GPIO84: U2.L5(IO_L18P_T2_35)
GPIO85: U2.L4(IO_L18N_T2_35)
GPIO86: U2.N4(IO_L19P_T3_35)
GPIO87: U2.N3(IO_L19N_T3_VREF_35)
GPIO88: U2.R1(IO_L20P_T3_35)
GPIO89: U2.P1(IO_L20N_T3_35)
GPIO90: U2.P5(IO_L21P_T3_DQS_35)
GPIO91: U2.P4(IO_L21N_T3_DQS_35)
GPIO92: U2.P2(IO_L22P_T3_35)
GPIO93: U2.N2(IO_L22N_T3_35)
GPIO94: U2.M6(IO_L23P_T3_35)
GPIO95: U2.M5(IO_L23N_T3_35)
GPIO96: U2.P6(IO_L24P_T3_35)
GPIO97: U2.N5(IO_L24N_T3_35)
GPIO98: U2.L6(IO_25_35)
GPIO99: U2.AA9(IO_L8P_T1_13)
GPIO100: U2.AB10(IO_L8N_T1_13)
GPIO101: U2.AA10(IO_L9P_T1_DQS_13)
GPIO102: U2.AA11(IO_L9N_T1_DQS_13)
GPIO103: U2.V10(IO_L10P_T1_13)
GPIO104: U2.W10(IO_L10N_T1_13)
GPIO105: U2.Y11(IO_L11P_T1_SRCC_13)
GPIO106: U2.Y12(IO_L11N_T1_SRCC_13)
GPIO107: U2.W11(IO_L12P_T1_MRCC_13)
GPIO108: U2.W12(IO_L12N_T1_MRCC_13)
GPIO109: U2.V13(IO_L13P_T2_MRCC_13)
GPIO110: U2.V14(IO_L13N_T2_MRCC_13)
GPIO111: U2.U15(IO_L14P_T2_SRCC_13)
GPIO112: U2.V15(IO_L14N_T2_SRCC_13)
GPIO113: U2.T14(IO_L15P_T2_DQS_13)
GPIO114: U2.T15(IO_L15N_T2_DQS_13)
GPIO115: U2.W15(IO_L16P_T2_13)
GPIO116: U2.W16(IO_L16N_T2_13)
GPIO117: U2.T16(IO_L17P_T2_13)
GPIO118: U2.U16(IO_L17N_T2_13)
INIT: U2.U12(INIT_B_0) ; port INIT
IO0: U2.AB12(IO_L7N_T1_13)
IO1: U2.AB11(IO_L7P_T1_13)
IO2: U2.Y14(IO_L6N_T0_VREF_13)
IO3: U2.W14(IO_L6P_T0_13)
IO4: U2.AA14(IO_L5N_T0_13)
IO5: U2.Y13(IO_L5P_T0_13)
IO6: U2.AB15(IO_L4N_T0_13)
IO7: U2.AA15(IO_L4P_T0_13)
M0: U2.U11(M0_0) ; port M0
M1: U2.U10(M1_0) ; port M1
M2: U2.U9(M2_0) ; port M2
MISO: U2.R22(IO_L1N_T0_D01_DIN_14) ; port MISO
MOSI: U2.P22(IO_L1P_T0_D00_MOSI_14) ; port MOSI
ODT0: U2.M18(IO_L16P_T2_A28_15) ; port ODT0
PROGRAM: U2.N12(PROGRAM_B_0) ; port PROGRAM
PUDC: U2.U22(IO_L3P_T0_DQS_PUDC_B_14) ; port PUDC
RAS: U2.J21(IO_L11N_T1_SRCC_15) ; port RAS
RE: U2.AA13(IO_L3P_T0_DQS_13)
RESET: U2.D14(IO_L6P_T0_16) ; port RESET
TCK: U2.V12(TCK_0) ; port TCK
TDI: U2.R13(TDI_0) ; port TDI
TDO: U2.U13(TDO_0) ; port TDO
TMS: U2.T13(TMS_0) ; port TMS
VN: U2.M9(VN_0) ; port VN
VP: U2.L10(VP_0) ; port VP
WE: U2.H19(IO_L12N_T1_MRCC_15) ; port WE
WE_NAND: U2.AA16(IO_L1N_T0_13)
WP: U2.AB16(IO_L2P_T0_13)

Not connected (* = marked no-connect by the designer): U2 A4(MGTPTXN0_216)* A6(MGTPTXN2_216)* A8(MGTPRXN0_216)* A10(MGTPRXN2_216)* B4(MGTPTXP0_216)* B6(MGTPTXP2_216)* B8(MGTPRXP0_216)* B10(MGTPRXP2_216)* C5(MGTPTXN1_216)* C7(MGTPTXN3_216)* C9(MGTPRXN3_216)* C11(MGTPRXN1_216)* D5(MGTPTXP1_216)* D7(MGTPTXP3_216)* D9(MGTPRXP3_216)* D11(MGTPRXP1_216)* E6(MGTREFCLK0N_216)* E10(MGTREFCLK1N_216)* F6(MGTREFCLK0P_216)* F8(MGTRREF_216)* F10(MGTREFCLK1P_216)*

### Buses and harness runs
bus A[15..0] = port A[15..0]
bus BA[2..0] = port BA[2..0]
bus DQ[63..0] = port DQ[63..0]
bus EIO[0..35] = port EIO[0..35]
bus GPIO[0..118] = port GPIO[0..118]

### Layout directives
differential pair: CK0_N, CK0_P, DQS0_N, DQS0_P, DQS1_N, DQS1_P, DQS2_N, DQS2_P, DQS3_N, DQS3_P, DQS4_N, DQS4_P, DQS5_N, DQS5_P, DQS6_N, DQS6_P, DQS7_N, DQS7_P

### Notes on the sheet
- DDR3L SODIMM RAM
- Power Delivery
- Startup Configuration
- ADC
- GPIO
- EIO
- JTAG
- Temp Sensor
- 100MHz Clock Input
- PARALLEL NAND FLASH
- POWER FILTERING
- GPIO AND FLASH HOOKUP
- RAM BANKS AND EIO (Extended IO)
- MGT AND DEDICATED LINES
- POWER
- (in symbol XC7A200T-2FBG484I, part A) BANK 13
- (in symbol XC7A200T-2FBG484I, part B) BANK 14
- (in symbol XC7A200T-2FBG484I, part C) BANK 15
- (in symbol XC7A200T-2FBG484I, part D) BANK 16
- (in symbol XC7A200T-2FBG484I, part E) BANK 34
- (in symbol XC7A200T-2FBG484I, part F) BANK 35

### Library data of the parts
C7 C9-C11 C16 C18-C20 C25 C27-C29 C34-C36 = 885012106015: CAP CER 0.47UF 16V X5R 0603; Manufacturer: Würth Elektronik; Tolerance: ±20%; Part Number: 885012106015; Value: 0.47µF; Applications: General Purpose; Capacitance: 0.47µF; ComponentLink1Description: Datasheet; ComponentLink1URL: https://katalog.we-online.de/pbs/datasheet/885012106015.pdf; ComponentLink2Description: DigiKey Link; ComponentLink2URL: http://digikey.com/product-detail/en/w-rth-elektronik/885012106015/732-7912-1-ND/5454539; Device Package: 0603 (1608 Metric); LastUpdated: 2020-09-02 1:03:18 AM; Lifecycle Status: Active; Minimum Order: 1; Mounting Type: Surface Mount, MLCC; Operating Temperature: -55°C ~ 85°C; Package / Case: 0603 (1608 Metric); Packaging: TapeAndReel; PartId: 11963; Part Status: Active; Price: 0.04; Series: WCAP-CSGP; Size / Dimension: 0.063" L x 0.031" W (1.60mm x 0.80mm); Supplier 1: DigiKey; Supplier Part Number 1: 732-7912-1-ND; Temperature Coefficient: X5R; Thickness (Max): 0.037" (0.95mm); Voltage - Rated: 16V
C8 C12-C15 C17 C21-C24 C26 C30-C33 C37-C40 = GRM21BR61A476ME15L: CAP CER 47UF 10V X5R 0805; Manufacturer: Murata Electronics; Tolerance: ±20%; Part Number: GRM21BR61A476ME15L; Value: 47µF; Applications: General Purpose; Capacitance: 47µF; ComponentLink1Description: Datasheet; ComponentLink1URL: https://search.murata.co.jp/Ceramy/image/img/A01X/G101/ENG/GRM21BR61A476ME15-01.pdf; ComponentLink2Description: DigiKey Link; ComponentLink2URL: http://digikey.com/product-detail/en/murata-electronics/GRM21BR61A476ME15L/490-9961-1-ND/5026442; Device Package: 0805 (2012 Metric); LastUpdated: 2020-09-02 1:04:38 AM; Lifecycle Status: Active; Minimum Order: 1; Mounting Type: Surface Mount, MLCC; Operating Temperature: -55°C ~ 85°C; Package / Case: 0805 (2012 Metric); Packaging: TapeAndReel; PartId: 4627; Part Status: Active; Price: 0.19; Series: GRM; Size / Dimension: 0.079" L x 0.049" W (2.00mm x 1.25mm); Supplier 1: DigiKey; Supplier Part Number 1: 490-9961-1-ND; Temperature Coefficient: X5R; Thickness (Max): 0.057" (1.45mm); Voltage - Rated: 10V
U2 = XC7A200T-2FBG484I: Artix-7 FPGA, 285 User I/Os, 4 GTP, 484-Ball BGA, Speed Grade 2, Industrial Grade, Pb-Free; Manufacturer: Xilinx; Block RAM Blocks (18Kb): 730; Block RAM Blocks (36Kb): 365; Block RAM Blocks (Max Kb): 13140; CLBs (Slices): 33650; Clock Mgmt Tiles (CMTs): 10; DSP48E1 Slices: 740; Logic Cells: 215360; Max User I/O: 500; Speed Grade: -2; DatasheetVersion: v1.12; PackageVersion: Rev 1.8; PackageReference: FBG484; PackageDescription: Flip-Chip Lidless BGA, Body 23 x 23 mm, 1.0 mm Pitch; Supplier 1: Digi-Key; Supplier Part Number 1: 122-1866-ND; CLBs (Max Distributed RAM Kb): 2888; Generic Part Number: XC7A200T; RoHS: Pb-Free; NexusDeviceID: XC7A200T-2FBG484I; Mounting Technology: Surface Mount; Code_JEDEC: MS-034; PartNumber: XC7A200T-2FBG484I; ComponentLink1Description: Manufacturer URL; ComponentLink1URL: http://www.xilinx.com/; ComponentLink2Description: Datasheet; ComponentLink2URL: http://www.xilinx.com/support/documentation/data_sheets/ds180_7Series_Overview.pdf; ComponentLink3Description: Package Specification; ComponentLink3URL: http://www.xilinx.com/support/documentation/user_guides/ug475_7Series_Pkg_Pinout.pdf; ComponentLink4Description: DC and Switching Characteristics; ComponentLink4URL: http://www.xilinx.com/support/documentation/data_sheets/ds181_Artix_7_Data_Sheet.pdf; ComponentLink5Description: Package File; ComponentLink5URL: http://www.xilinx.com/support/packagefiles/a7packages/xc7a200tfbg484pkg.txt; ComponentLink6Description: Packaging and Pinout; ComponentLink6URL: http://www.xilinx.com/support/documentation/user_guides/ug475_7Series_Pkg_Pinout.pdf

## Sheet Connector Array.SchDoc
size A2; SheetNumber: 2; SheetTotal: 3
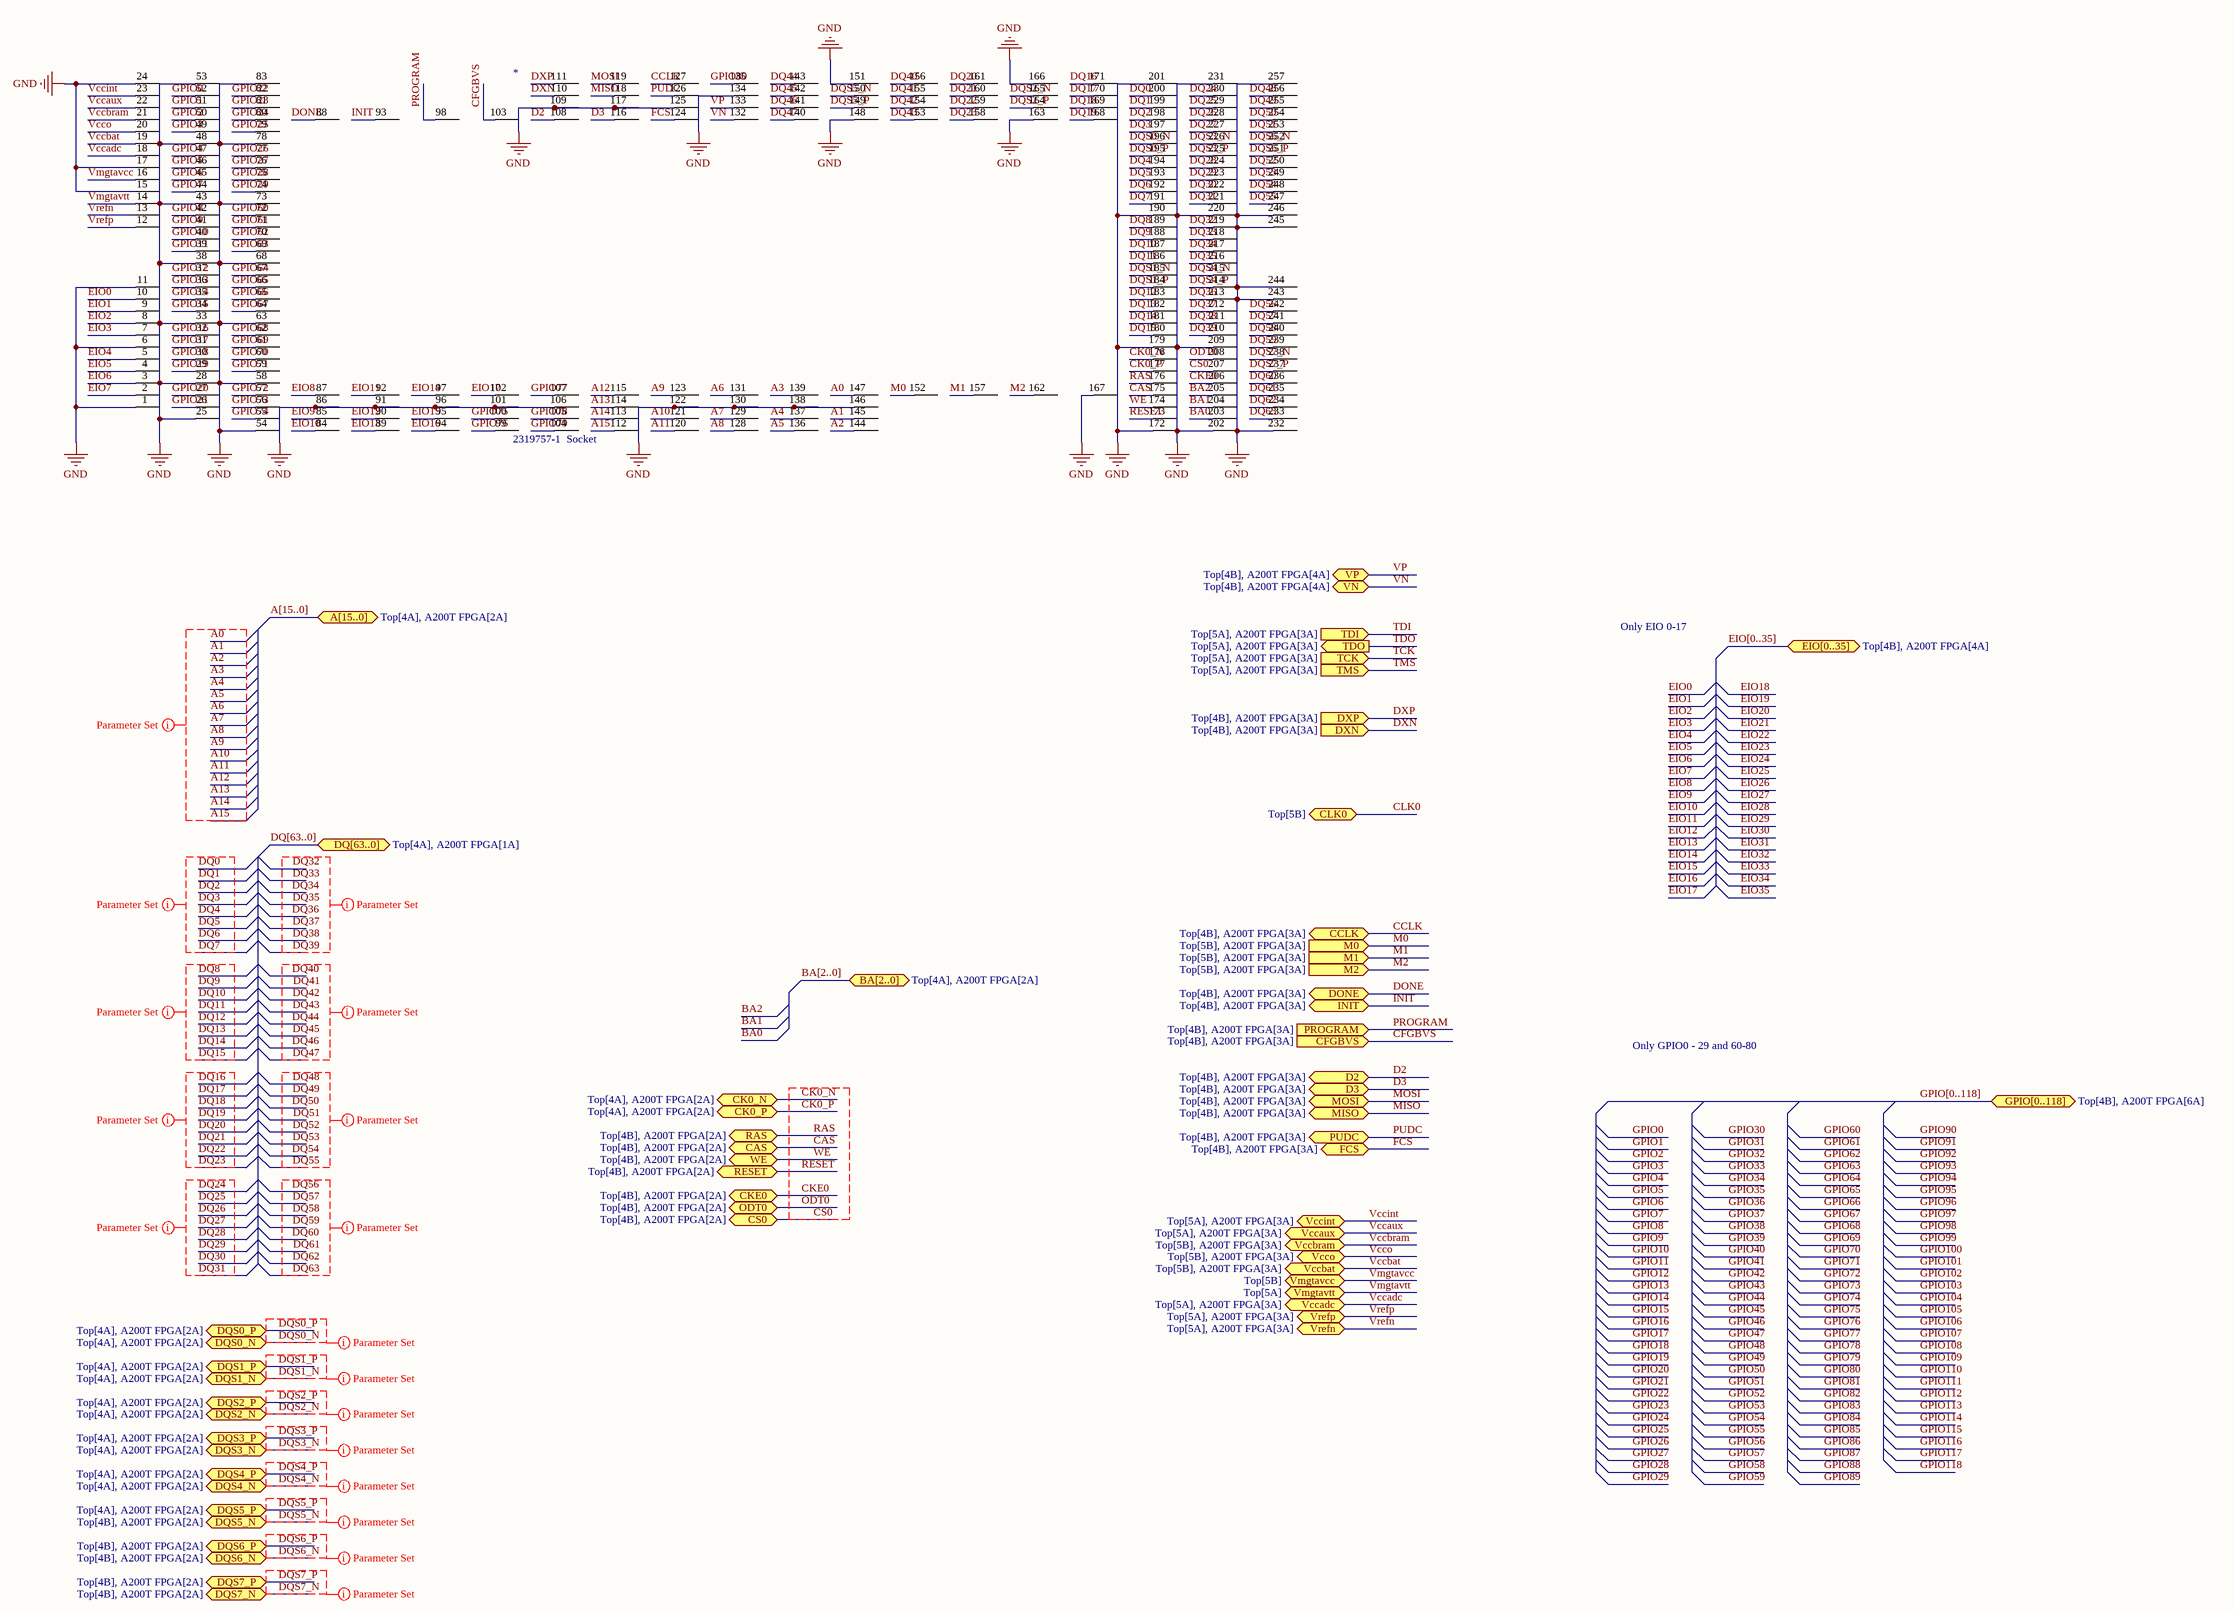
[diagram p3: Connector Array.SchDoc]

### Parts
*  2319757-1  Socket  [2319757-1  LGA Socket]

### Ports
A[15..0] (bidir, see Top[4A], A200T FPGA[2A]), BA[2..0] (bidir, see Top[4A], A200T FPGA[2A]), CAS (bidir, see Top[4B], A200T FPGA[2A]), CCLK (bidir, see Top[4B], A200T FPGA[3A]), CFGBVS (in, see Top[4B], A200T FPGA[3A]), CK0_N (bidir, see Top[4A], A200T FPGA[2A]), CK0_P (bidir, see Top[4A], A200T FPGA[2A]), CKE0 (bidir, see Top[4B], A200T FPGA[2A]), CLK0 (bidir, see Top[5B]), CS0 (bidir, see Top[4B], A200T FPGA[2A]), D2 (bidir, see Top[4B], A200T FPGA[3A]), D3 (bidir, see Top[4B], A200T FPGA[3A]), DONE (bidir, see Top[4B], A200T FPGA[3A]), DQ[63..0] (bidir, see Top[4A], A200T FPGA[1A]), DQS0_N (bidir, see Top[4A], A200T FPGA[2A]), DQS0_P (bidir, see Top[4A], A200T FPGA[2A]), DQS1_N (bidir, see Top[4A], A200T FPGA[2A]), DQS1_P (bidir, see Top[4A], A200T FPGA[2A]), DQS2_N (bidir, see Top[4A], A200T FPGA[2A]), DQS2_P (bidir, see Top[4A], A200T FPGA[2A]), DQS3_N (bidir, see Top[4A], A200T FPGA[2A]), DQS3_P (bidir, see Top[4A], A200T FPGA[2A]), DQS4_N (bidir, see Top[4A], A200T FPGA[2A]), DQS4_P (bidir, see Top[4A], A200T FPGA[2A]), DQS5_N (bidir, see Top[4B], A200T FPGA[2A]), DQS5_P (bidir, see Top[4A], A200T FPGA[2A]), DQS6_N (bidir, see Top[4B], A200T FPGA[2A]), DQS6_P (bidir, see Top[4B], A200T FPGA[2A]), DQS7_N (bidir, see Top[4B], A200T FPGA[2A]), DQS7_P (bidir, see Top[4B], A200T FPGA[2A]), DXN (in, see Top[4B], A200T FPGA[3A]), DXP (in, see Top[4B], A200T FPGA[3A]), EIO[0..35] (bidir, see Top[4B], A200T FPGA[4A]), FCS (bidir, see Top[4B], A200T FPGA[3A]), GPIO[0..118] (bidir, see Top[4B], A200T FPGA[6A]), INIT (bidir, see Top[4B], A200T FPGA[3A]), M0 (in, see Top[5B], A200T FPGA[3A]), M1 (in, see Top[5B], A200T FPGA[3A]), M2 (in, see Top[5B], A200T FPGA[3A]), MISO (bidir, see Top[4B], A200T FPGA[3A]), MOSI (bidir, see Top[4B], A200T FPGA[3A]), ODT0 (bidir, see Top[4B], A200T FPGA[2A]), PROGRAM (in, see Top[4B], A200T FPGA[3A]), PUDC (bidir, see Top[4B], A200T FPGA[3A]), RAS (bidir, see Top[4B], A200T FPGA[2A]), RESET (bidir, see Top[4B], A200T FPGA[2A]), TCK (in, see Top[5A], A200T FPGA[3A]), TDI (in, see Top[5A], A200T FPGA[3A]), TDO (out, see Top[5A], A200T FPGA[3A]), TMS (in, see Top[5A], A200T FPGA[3A]), Vccadc (bidir, see Top[5A], A200T FPGA[3A]), Vccaux (bidir, see Top[5A], A200T FPGA[3A]), Vccbat (bidir, see Top[5B], A200T FPGA[3A]), Vccbram (bidir, see Top[5B], A200T FPGA[3A]), Vccint (bidir, see Top[5A], A200T FPGA[3A]), Vcco (bidir, see Top[5B], A200T FPGA[3A]), Vmgtavcc (bidir, see Top[5B]), Vmgtavtt (bidir, see Top[5A]), VN (bidir, see Top[4B], A200T FPGA[4A]), VP (bidir, see Top[4B], A200T FPGA[4A]), Vrefn (bidir, see Top[5A], A200T FPGA[3A]), Vrefp (bidir, see Top[5A], A200T FPGA[3A]), WE (bidir, see Top[4B], A200T FPGA[2A])

### Nets
Vccadc: *.18 *.22 ; port Vccaux, port Vccadc  [also labelled Vccaux]
Vccbat: *.1 *.6 *.11 *.13 *.15 *.17 *.19 *.24 *.25 *.28 *.33 *.38 *.43 *.48 *.53 *.54 *.58 *.63 *.68 *.73 *.78 *.83 *.86 *.91 *.96 *.101 *.106 *.109 *.117 *.122 *.125 *.130 *.134 *.138 *.146 *.148 *.151 *.163 *.166 *.167 *.172 *.179 *.190 *.201 *.202 *.209 *.220 *.231 *.232 *.243 *.244 *.245 *.246 *.257 ; port Vccbat, port Vrefn  [also labelled GND, Vrefn]
Vccbram: *.14 *.21 *.23 ; port Vccint, port Vccbram, port Vmgtavtt  [also labelled Vccint, Vmgtavtt]
Vcco: *.20 ; port Vcco
Vmgtavcc: *.16 ; port Vmgtavcc
Vrefp: *.12 ; port Vrefp
A0: *.147
A1: *.145
A2: *.144
A3: *.139
A4: *.137
A5: *.136
A6: *.131
A7: *.129
A8: *.128
A9: *.123
A10: *.121
A11: *.120
A12: *.115
A13: *.114
A14: *.113
A15: *.112
BA0: *.203
BA1: *.204
BA2: *.205
CAS: *.175 ; port CAS
CCLK: *.127 ; port CCLK
CFGBVS: *.103 ; port CFGBVS
CK0_N: *.178 ; port CK0_N
CK0_P: *.177 ; port CK0_P
CKE0: *.206 ; port CKE0
CS0: *.207 ; port CS0
D2: *.108 ; port D2
D3: *.116 ; port D3
DONE: *.88 ; port DONE
DQ0: *.200
DQ1: *.199
DQ2: *.198
DQ3: *.197
DQ4: *.194
DQ5: *.193
DQ6: *.192
DQ7: *.191
DQ8: *.189
DQ9: *.188
DQ10: *.187
DQ11: *.186
DQ12: *.183
DQ13: *.182
DQ14: *.181
DQ15: *.180
DQ16: *.171
DQ17: *.170
DQ18: *.169
DQ19: *.168
DQ20: *.161
DQ21: *.160
DQ22: *.159
DQ23: *.158
DQ24: *.230
DQ25: *.229
DQ26: *.228
DQ27: *.227
DQ28: *.224
DQ29: *.223
DQ30: *.222
DQ31: *.221
DQ32: *.219
DQ33: *.218
DQ34: *.217
DQ35: *.216
DQ36: *.213
DQ37: *.212
DQ38: *.211
DQ39: *.210
DQ40: *.156
DQ41: *.155
DQ42: *.154
DQ43: *.153
DQ44: *.143
DQ45: *.142
DQ46: *.141
DQ47: *.140
DQ48: *.256
DQ49: *.255
DQ50: *.254
DQ51: *.253
DQ52: *.250
DQ53: *.249
DQ54: *.248
DQ55: *.247
DQ56: *.242
DQ57: *.241
DQ58: *.240
DQ59: *.239
DQ60: *.236
DQ61: *.235
DQ62: *.234
DQ63: *.233
DQS0_N: *.196 ; port DQS0_N
DQS0_P: *.195 ; port DQS0_P
DQS1_N: *.185 ; port DQS1_N
DQS1_P: *.184 ; port DQS1_P
DQS2_N: *.165 ; port DQS2_N
DQS2_P: *.164 ; port DQS2_P
DQS3_N: *.226 ; port DQS3_N
DQS3_P: *.225 ; port DQS3_P
DQS4_N: *.215 ; port DQS4_N
DQS4_P: *.214 ; port DQS4_P
DQS5_N: *.150 ; port DQS5_N
DQS5_P: *.149 ; port DQS5_P
DQS6_N: *.252 ; port DQS6_N
DQS6_P: *.251 ; port DQS6_P
DQS7_N: *.238 ; port DQS7_N
DQS7_P: *.237 ; port DQS7_P
DXN: *.110 ; port DXN
DXP: *.111 ; port DXP
EIO0: *.10
EIO1: *.9
EIO2: *.8
EIO3: *.7
EIO4: *.5
EIO5: *.4
EIO6: *.3
EIO7: *.2
EIO8: *.87
EIO9: *.85
EIO10: *.84
EIO11: *.92
EIO12: *.90
EIO13: *.89
EIO14: *.97
EIO15: *.95
EIO16: *.94
EIO17: *.102
FCS: *.124 ; port FCS
GPIO0: *.52
GPIO1: *.51
GPIO2: *.50
GPIO3: *.49
GPIO4: *.47
GPIO5: *.46
GPIO6: *.45
GPIO7: *.44
GPIO8: *.42
GPIO9: *.41
GPIO10: *.40
GPIO11: *.39
GPIO12: *.37
GPIO13: *.36
GPIO14: *.35
GPIO15: *.34
GPIO16: *.32
GPIO17: *.31
GPIO18: *.30
GPIO19: *.29
GPIO20: *.27
GPIO21: *.26
GPIO22: *.82
GPIO23: *.81
GPIO24: *.80
GPIO25: *.79
GPIO26: *.77
GPIO27: *.76
GPIO28: *.75
GPIO29: *.74
GPIO60: *.72
GPIO61: *.71
GPIO62: *.70
GPIO63: *.69
GPIO64: *.67
GPIO65: *.66
GPIO66: *.65
GPIO67: *.64
GPIO68: *.62
GPIO69: *.61
GPIO70: *.60
GPIO71: *.59
GPIO72: *.57
GPIO73: *.56
GPIO74: *.55
GPIO75: *.100
GPIO76: *.99
GPIO77: *.107
GPIO78: *.105
GPIO79: *.104
GPIO80: *.135
INIT: *.93 ; port INIT
M0: *.152 ; port M0
M1: *.157 ; port M1
M2: *.162 ; port M2
MISO: *.118 ; port MISO
MOSI: *.119 ; port MOSI
ODT0: *.208 ; port ODT0
PROGRAM: *.98 ; port PROGRAM
PUDC: *.126 ; port PUDC
RAS: *.176 ; port RAS
RESET: *.173 ; port RESET
VN: *.132 ; port VN
VP: *.133 ; port VP
WE: *.174 ; port WE

### Buses and harness runs
bus A[15..0] = port A[15..0]
bus BA[2..0] = port BA[2..0]
bus DQ[63..0] = port DQ[63..0]
bus EIO[0..35] = port EIO[0..35]
bus GPIO[0..118] = port GPIO[0..118]

### Layout directives
net class DG_0: DQ0, DQ1, DQ2, DQ3, DQ4, DQ5, DQ6, DQ7, DQS0_N, DQS0_P
net class DG_1: DQ8, DQ9, DQ10, DQ11, DQ12, DQ13, DQ14, DQ15, DQS1_N, DQS1_P
net class DG_2: DQ16, DQ17, DQ18, DQ19, DQ20, DQ21, DQ22, DQ23, DQS2_N, DQS2_P
net class DG_3: DQ24, DQ25, DQ26, DQ27, DQ28, DQ29, DQ30, DQ31, DQS3_N, DQS3_P
net class DG_7: DQ56, DQ57, DQ58, DQ59, DQ60, DQ61, DQ62, DQ63, DQS7_N, DQS7_P
net class DG_6: DQ48, DQ49, DQ50, DQ51, DQ52, DQ53, DQ54, DQ55, DQS6_N, DQS6_P
net class DG_5: DQ40, DQ41, DQ42, DQ43, DQ44, DQ45, DQ46, DQ47, DQS5_N, DQS5_P
net class DG_4: DQ32, DQ33, DQ34, DQ35, DQ36, DQ37, DQ38, DQ39, DQS4_N, DQS4_P
net class CG: A0, A1, A2, A3, A4, A5, A6, A7, A8, A9, A10, A11, A12, A13, A14, A15

### Notes on the sheet
- Only EIO 0-17
- Only GPIO0 - 29 and 60-80

## Nets that join several sheets
Vccadc: Top (TP9.1), A200T FPGA (15 pins), Connector Array (*.18 *.22)
Vccbat: Top (5 pins), A200T FPGA (124 pins), Connector Array (54 pins)
Vccbram: Top (TP6.1), A200T FPGA (33 pins), Connector Array (*.14 *.21 *.23)
Vcco: Top (6 pins), A200T FPGA (51 pins), Connector Array (*.20)
Vmgtavcc: Top (TP8.1), A200T FPGA (6 pins), Connector Array (*.16)
Vrefp: Top (TP7.1), A200T FPGA (U2.M10), Connector Array (*.12)
A0: A200T FPGA (U2.K22), Connector Array (*.147)
A1: A200T FPGA (U2.K21), Connector Array (*.145)
A2: A200T FPGA (U2.G20), Connector Array (*.144)
A3: A200T FPGA (U2.H20), Connector Array (*.139)
A4: A200T FPGA (U2.H22), Connector Array (*.137)
A5: A200T FPGA (U2.J22), Connector Array (*.136)
A6: A200T FPGA (U2.H18), Connector Array (*.131)
A7: A200T FPGA (U2.H17), Connector Array (*.129)
A8: A200T FPGA (U2.H15), Connector Array (*.128)
A9: A200T FPGA (U2.J15), Connector Array (*.123)
A10: A200T FPGA (U2.G18), Connector Array (*.121)
A11: A200T FPGA (U2.G17), Connector Array (*.120)
A12: A200T FPGA (U2.G16), Connector Array (*.115)
A13: A200T FPGA (U2.G15), Connector Array (*.114)
A14: A200T FPGA (U2.G13), Connector Array (*.113)
A15: A200T FPGA (U2.H13), Connector Array (*.112)
BA0: A200T FPGA (U2.J20), Connector Array (*.203)
BA1: A200T FPGA (U2.L21), Connector Array (*.204)
BA2: A200T FPGA (U2.M21), Connector Array (*.205)
CAS: A200T FPGA (U2.J19), Connector Array (*.175)
CCLK: A200T FPGA (U2.L12), Connector Array (*.127)
CFGBVS: A200T FPGA (U2.U8), Connector Array (*.103)
CK0_N: A200T FPGA (U2.H14), Connector Array (*.178)
CK0_P: A200T FPGA (U2.J14), Connector Array (*.177)
CKE0: A200T FPGA (U2.M22), Connector Array (*.206)
CLK0: Top (P5.2 Q1.3), A200T FPGA (U2.T5)
CS0: A200T FPGA (U2.N22), Connector Array (*.207)
D2: A200T FPGA (U2.P21), Connector Array (*.108)
D3: A200T FPGA (U2.R21), Connector Array (*.116)
DONE: A200T FPGA (U2.G11), Connector Array (*.88)
DQ0: A200T FPGA (U2.F13), Connector Array (*.200)
DQ1: A200T FPGA (U2.F14), Connector Array (*.199)
DQ2: A200T FPGA (U2.F16), Connector Array (*.198)
DQ3: A200T FPGA (U2.E17), Connector Array (*.197)
DQ4: A200T FPGA (U2.E13), Connector Array (*.194)
DQ5: A200T FPGA (U2.E14), Connector Array (*.193)
DQ6: A200T FPGA (U2.E16), Connector Array (*.192)
DQ7: A200T FPGA (U2.D16), Connector Array (*.191)
DQ8: A200T FPGA (U2.B15), Connector Array (*.189)
DQ9: A200T FPGA (U2.B16), Connector Array (*.188)
DQ10: A200T FPGA (U2.C13), Connector Array (*.187)
DQ11: A200T FPGA (U2.B13), Connector Array (*.186)
DQ12: A200T FPGA (U2.A13), Connector Array (*.183)
DQ13: A200T FPGA (U2.A14), Connector Array (*.182)
DQ14: A200T FPGA (U2.B17), Connector Array (*.181)
DQ15: A200T FPGA (U2.B18), Connector Array (*.180)
DQ16: A200T FPGA (U2.E19), Connector Array (*.171)
DQ17: A200T FPGA (U2.D19), Connector Array (*.170)
DQ18: A200T FPGA (U2.B20), Connector Array (*.169)
DQ19: A200T FPGA (U2.A20), Connector Array (*.168)
DQ20: A200T FPGA (U2.A18), Connector Array (*.161)
DQ21: A200T FPGA (U2.A19), Connector Array (*.160)
DQ22: A200T FPGA (U2.F19), Connector Array (*.159)
DQ23: A200T FPGA (U2.F20), Connector Array (*.158)
DQ24: A200T FPGA (U2.D20), Connector Array (*.230)
DQ25: A200T FPGA (U2.C20), Connector Array (*.229)
DQ26: A200T FPGA (U2.C22), Connector Array (*.228)
DQ27: A200T FPGA (U2.B22), Connector Array (*.227)
DQ28: A200T FPGA (U2.E22), Connector Array (*.224)
DQ29: A200T FPGA (U2.D22), Connector Array (*.223)
DQ30: A200T FPGA (U2.E21), Connector Array (*.222)
DQ31: A200T FPGA (U2.D21), Connector Array (*.221)
DQ32: A200T FPGA (U2.K13), Connector Array (*.219)
DQ33: A200T FPGA (U2.K14), Connector Array (*.218)
DQ34: A200T FPGA (U2.M13), Connector Array (*.217)
DQ35: A200T FPGA (U2.L13), Connector Array (*.216)
DQ36: A200T FPGA (U2.L14), Connector Array (*.213)
DQ37: A200T FPGA (U2.L15), Connector Array (*.212)
DQ38: A200T FPGA (U2.L16), Connector Array (*.211)
DQ39: A200T FPGA (U2.K16), Connector Array (*.210)
DQ40: A200T FPGA (U2.W21), Connector Array (*.156)
DQ41: A200T FPGA (U2.W22), Connector Array (*.155)
DQ42: A200T FPGA (U2.AA20), Connector Array (*.154)
DQ43: A200T FPGA (U2.AA21), Connector Array (*.153)
DQ44: A200T FPGA (U2.AB21), Connector Array (*.143)
DQ45: A200T FPGA (U2.AB22), Connector Array (*.142)
DQ46: A200T FPGA (U2.U20), Connector Array (*.141)
DQ47: A200T FPGA (U2.V20), Connector Array (*.140)
DQ48: A200T FPGA (U2.V18), Connector Array (*.256)
DQ49: A200T FPGA (U2.V19), Connector Array (*.255)
DQ50: A200T FPGA (U2.V17), Connector Array (*.254)
DQ51: A200T FPGA (U2.W17), Connector Array (*.253)
DQ52: A200T FPGA (U2.AA18), Connector Array (*.250)
DQ53: A200T FPGA (U2.AB18), Connector Array (*.249)
DQ54: A200T FPGA (U2.U17), Connector Array (*.248)
DQ55: A200T FPGA (U2.U18), Connector Array (*.247)
DQ56: A200T FPGA (U2.P14), Connector Array (*.242)
DQ57: A200T FPGA (U2.R14), Connector Array (*.241)
DQ58: A200T FPGA (U2.R18), Connector Array (*.240)
DQ59: A200T FPGA (U2.T18), Connector Array (*.239)
DQ60: A200T FPGA (U2.P15), Connector Array (*.236)
DQ61: A200T FPGA (U2.R16), Connector Array (*.235)
DQ62: A200T FPGA (U2.N13), Connector Array (*.234)
DQ63: A200T FPGA (U2.N14), Connector Array (*.233)
DQS0_N: A200T FPGA (U2.C15), Connector Array (*.196)
DQS0_P: A200T FPGA (U2.C14), Connector Array (*.195)
DQS1_N: A200T FPGA (U2.A16), Connector Array (*.185)
DQS1_P: A200T FPGA (U2.A15), Connector Array (*.184)
DQS2_N: A200T FPGA (U2.E18), Connector Array (*.165)
DQS2_P: A200T FPGA (U2.F18), Connector Array (*.164)
DQS3_N: A200T FPGA (U2.A21), Connector Array (*.226)
DQS3_P: A200T FPGA (U2.B21), Connector Array (*.225)
DQS4_N: A200T FPGA (U2.J17), Connector Array (*.215)
DQS4_P: A200T FPGA (U2.K17), Connector Array (*.214)
DQS5_N: A200T FPGA (U2.Y22), Connector Array (*.150)
DQS5_P: A200T FPGA (U2.Y21), Connector Array (*.149)
DQS6_N: A200T FPGA (U2.AB20), Connector Array (*.252)
DQS6_P: A200T FPGA (U2.AA19), Connector Array (*.251)
DQS7_N: A200T FPGA (U2.P17), Connector Array (*.238)
DQS7_P: A200T FPGA (U2.N17), Connector Array (*.237)
DXN: A200T FPGA (U2.N9), Connector Array (*.110)
DXP: A200T FPGA (U2.N10), Connector Array (*.111)
EIO0: A200T FPGA (U2.J16), Connector Array (*.10)
EIO1: A200T FPGA (U2.K18), Connector Array (*.9)
EIO2: A200T FPGA (U2.K19), Connector Array (*.8)
EIO3: A200T FPGA (U2.L19), Connector Array (*.7)
EIO4: A200T FPGA (U2.L20), Connector Array (*.5)
EIO5: A200T FPGA (U2.L18), Connector Array (*.4)
EIO6: A200T FPGA (U2.N18), Connector Array (*.3)
EIO7: A200T FPGA (U2.N19), Connector Array (*.2)
EIO8: A200T FPGA (U2.N20), Connector Array (*.87)
EIO9: A200T FPGA (U2.M20), Connector Array (*.85)
EIO10: A200T FPGA (U2.M15), Connector Array (*.84)
EIO11: A200T FPGA (U2.M16), Connector Array (*.92)
EIO12: A200T FPGA (U2.M17), Connector Array (*.90)
EIO13: A200T FPGA (U2.F15), Connector Array (*.89)
EIO14: A200T FPGA (U2.D15), Connector Array (*.97)
EIO15: A200T FPGA (U2.D17), Connector Array (*.95)
EIO16: A200T FPGA (U2.C17), Connector Array (*.94)
EIO17: A200T FPGA (U2.C18), Connector Array (*.102)
FCS: A200T FPGA (U2.T19), Connector Array (*.124)
GPIO0: A200T FPGA (U2.T3), Connector Array (*.52)
GPIO1: A200T FPGA (U2.T1), Connector Array (*.51)
GPIO2: A200T FPGA (U2.U1), Connector Array (*.50)
GPIO3: A200T FPGA (U2.U2), Connector Array (*.49)
GPIO4: A200T FPGA (U2.V2), Connector Array (*.47)
GPIO5: A200T FPGA (U2.R3), Connector Array (*.46)
GPIO6: A200T FPGA (U2.R2), Connector Array (*.45)
GPIO7: A200T FPGA (U2.W2), Connector Array (*.44)
GPIO8: A200T FPGA (U2.Y2), Connector Array (*.42)
GPIO9: A200T FPGA (U2.W1), Connector Array (*.41)
GPIO10: A200T FPGA (U2.Y1), Connector Array (*.40)
GPIO11: A200T FPGA (U2.U3), Connector Array (*.39)
GPIO12: A200T FPGA (U2.V3), Connector Array (*.37)
GPIO13: A200T FPGA (U2.AA1), Connector Array (*.36)
GPIO14: A200T FPGA (U2.AB1), Connector Array (*.35)
GPIO15: A200T FPGA (U2.AB3), Connector Array (*.34)
GPIO16: A200T FPGA (U2.AB2), Connector Array (*.32)
GPIO17: A200T FPGA (U2.Y3), Connector Array (*.31)
GPIO18: A200T FPGA (U2.AA3), Connector Array (*.30)
GPIO19: A200T FPGA (U2.AA5), Connector Array (*.29)
GPIO20: A200T FPGA (U2.AB5), Connector Array (*.27)
GPIO21: A200T FPGA (U2.Y4), Connector Array (*.26)
GPIO22: A200T FPGA (U2.AA4), Connector Array (*.82)
GPIO23: A200T FPGA (U2.V4), Connector Array (*.81)
GPIO24: A200T FPGA (U2.W4), Connector Array (*.80)
GPIO25: A200T FPGA (U2.R4), Connector Array (*.79)
GPIO26: A200T FPGA (U2.T4), Connector Array (*.77)
GPIO27: A200T FPGA (U2.U5), Connector Array (*.76)
GPIO28: A200T FPGA (U2.W6), Connector Array (*.75)
GPIO29: A200T FPGA (U2.W5), Connector Array (*.74)
GPIO60: A200T FPGA (U2.F3), Connector Array (*.72)
GPIO61: A200T FPGA (U2.E3), Connector Array (*.71)
GPIO62: A200T FPGA (U2.K1), Connector Array (*.70)
GPIO63: A200T FPGA (U2.J1), Connector Array (*.69)
GPIO64: A200T FPGA (U2.H2), Connector Array (*.67)
GPIO65: A200T FPGA (U2.G2), Connector Array (*.66)
GPIO66: A200T FPGA (U2.K2), Connector Array (*.65)
GPIO67: A200T FPGA (U2.J2), Connector Array (*.64)
GPIO68: A200T FPGA (U2.J5), Connector Array (*.62)
GPIO69: A200T FPGA (U2.H5), Connector Array (*.61)
GPIO70: A200T FPGA (U2.H3), Connector Array (*.60)
GPIO71: A200T FPGA (U2.G3), Connector Array (*.59)
GPIO72: A200T FPGA (U2.H4), Connector Array (*.57)
GPIO73: A200T FPGA (U2.G4), Connector Array (*.56)
GPIO74: A200T FPGA (U2.K4), Connector Array (*.55)
GPIO75: A200T FPGA (U2.J4), Connector Array (*.100)
GPIO76: A200T FPGA (U2.L3), Connector Array (*.99)
GPIO77: A200T FPGA (U2.K3), Connector Array (*.107)
GPIO78: A200T FPGA (U2.M1), Connector Array (*.105)
GPIO79: A200T FPGA (U2.L1), Connector Array (*.104)
GPIO80: A200T FPGA (U2.M3), Connector Array (*.135)
INIT: A200T FPGA (U2.U12), Connector Array (*.93)
M0: Top (P3.2), A200T FPGA (U2.U11), Connector Array (*.152)
M1: Top (P2.2), A200T FPGA (U2.U10), Connector Array (*.157)
M2: Top (P1.2), A200T FPGA (U2.U9), Connector Array (*.162)
MISO: A200T FPGA (U2.R22), Connector Array (*.118)
MOSI: A200T FPGA (U2.P22), Connector Array (*.119)
ODT0: A200T FPGA (U2.M18), Connector Array (*.208)
PROGRAM: A200T FPGA (U2.N12), Connector Array (*.98)
PUDC: A200T FPGA (U2.U22), Connector Array (*.126)
RAS: A200T FPGA (U2.J21), Connector Array (*.176)
RESET: A200T FPGA (U2.D14), Connector Array (*.173)
TCK: Top (P4.2), A200T FPGA (U2.V12)
TDI: Top (P4.3), A200T FPGA (U2.R13)
TDO: Top (P4.1), A200T FPGA (U2.U13)
TMS: Top (P4.4), A200T FPGA (U2.T13)
VN: A200T FPGA (U2.M9), Connector Array (*.132)
VP: A200T FPGA (U2.L10), Connector Array (*.133)
WE: A200T FPGA (U2.H19), Connector Array (*.174)